# EAGLE design rekick2015-003 (EAGLE 7.5.0)

## Sheet 1 of 7: Spannungsversorgung Primärseite
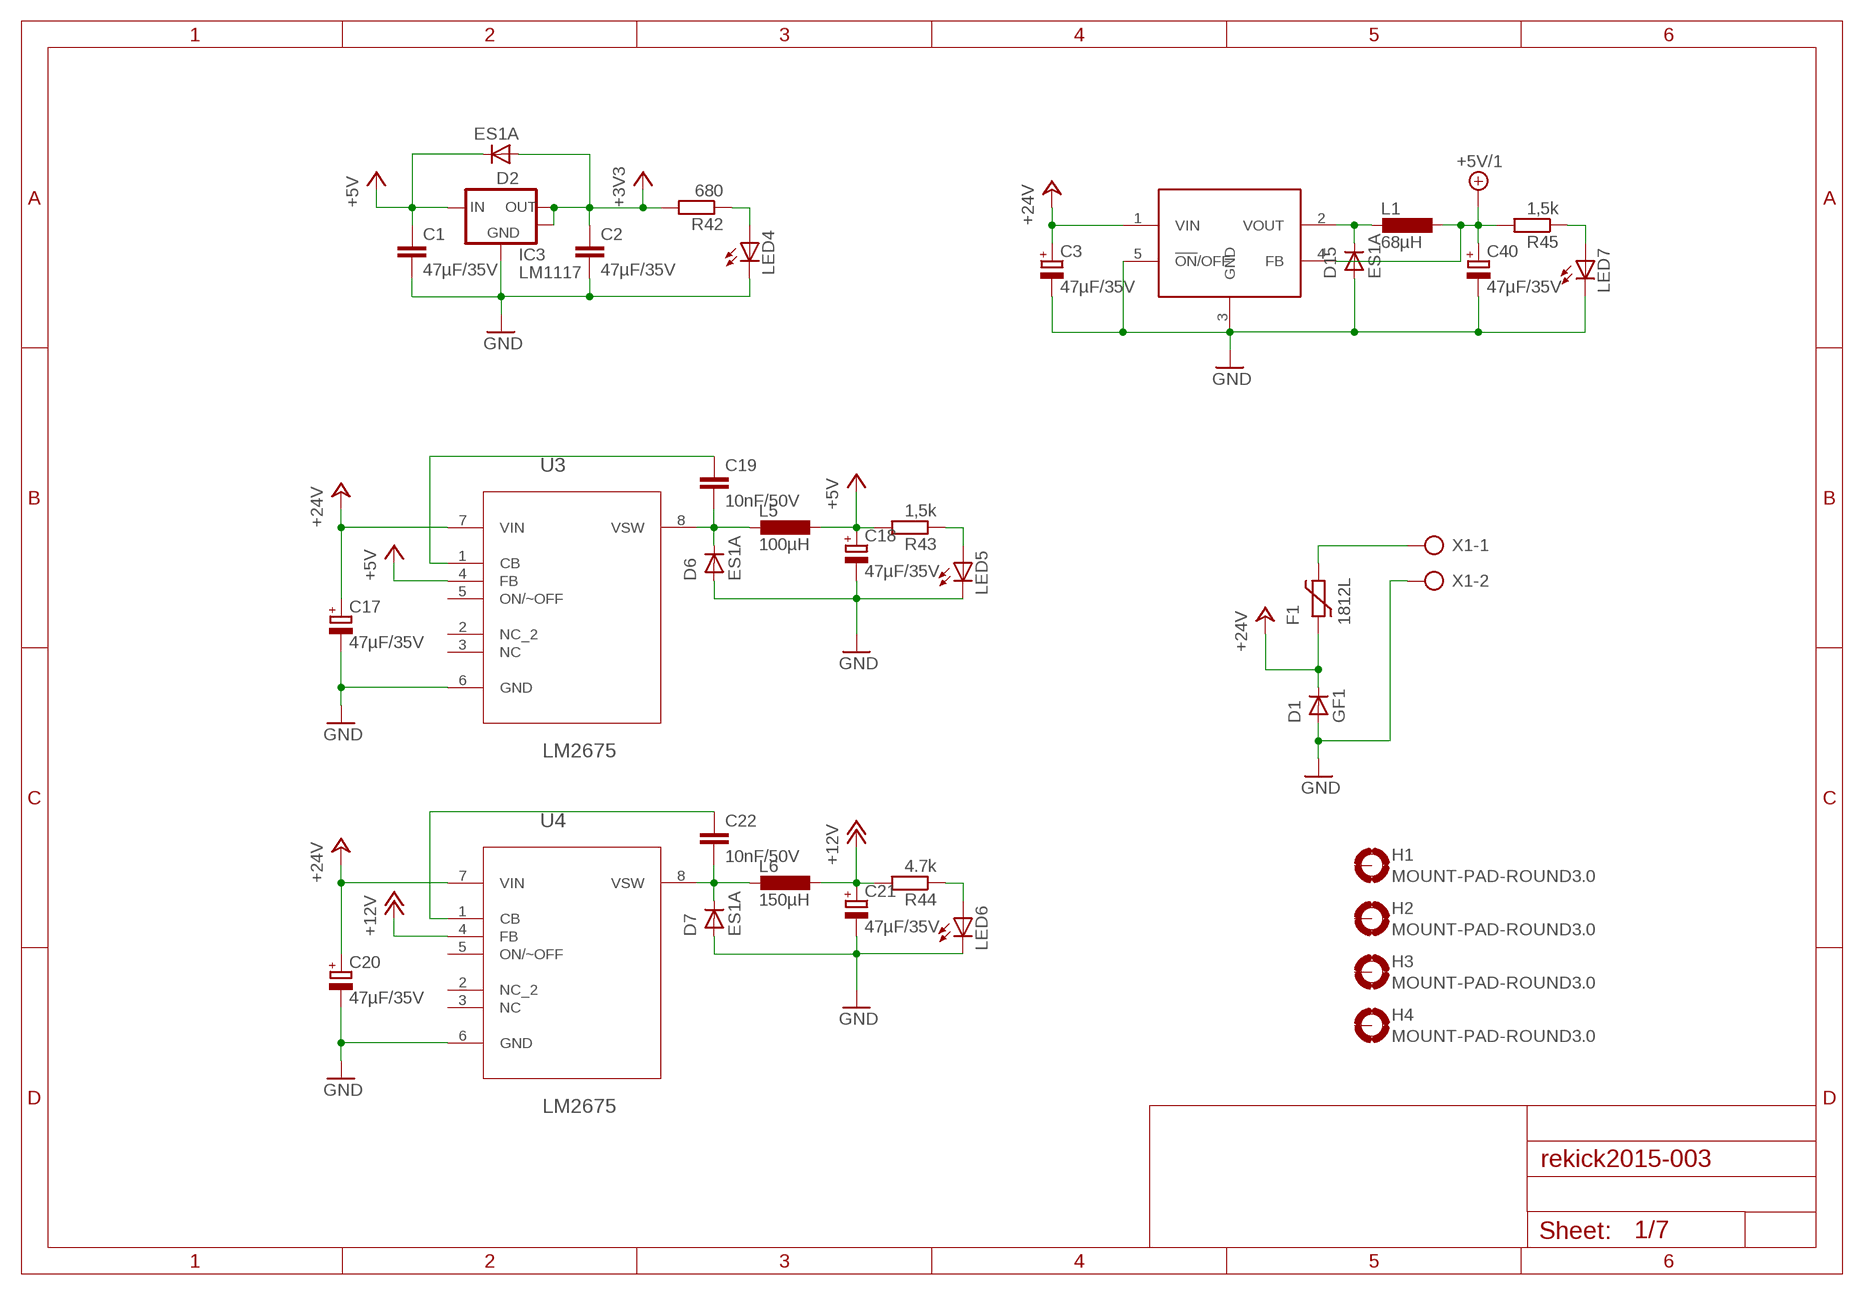
[diagram p0: schematic, sheet 1]

### Parts
C1  47µF/35V  C-EUC0603  [C0603]
C2  47µF/35V  C-EUC0603  [C0603]
C3  47µF/35V  CPOL-EUD  [PANASONIC_D]
C17  47µF/35V  CPOL-EUD  [PANASONIC_D]
C18  47µF/35V  CPOL-EUD  [PANASONIC_D]
C19  10nF/50V  C-EUC0603  [C0603]
C20  47µF/35V  CPOL-EUD  [PANASONIC_D]
C21  47µF/35V  CPOL-EUD  [PANASONIC_D]
C22  10nF/50V  C-EUC0603  [C0603]
C40  47µF/35V  CPOL-EUD  [PANASONIC_D]
D1  GF1  [SMA-DO214AC]
D2  ES1A  GF1  [SMA-DO214AC]
D6  ES1A  GF1  [SMA-DO214AC]
D7  ES1A  GF1  [SMA-DO214AC]
D15  ES1A  GF1  [SMA-DO214AC]
F1  1812L  [1812L]
H1  MOUNT-PAD-ROUND3.0  [3,0-PAD]
H2  MOUNT-PAD-ROUND3.0  [3,0-PAD]
H3  MOUNT-PAD-ROUND3.0  [3,0-PAD]
H4  MOUNT-PAD-ROUND3.0  [3,0-PAD]
IC3  LM1117  [SOT223]
L1  68µH  L-EUPISM  [PISM]
L5  100µH  L-EUPISM  [PISM]
L6  150µH  L-EUPISM  [PISM]
LED4  LEDCHIP-LED0805  [CHIP-LED0805]
LED5  LEDCHIP-LED0805  [CHIP-LED0805]
LED6  LEDCHIP-LED0805  [CHIP-LED0805]
LED7  LEDCHIP-LED0805  [CHIP-LED0805]
R42  680  R-EU_R0805  [R0805]
R43  1,5k  R-EU_R0805  [R0805]
R44  4.7k  R-EU_R0805  [R0805]
R45  1,5k  R-EU_R0805  [R0805]
U3  LM2675  LM2675M-3.3  [SOIC127P620X175-8N]
U4  LM2675  LM2675M-3.3  [SOIC127P620X175-8N]
U$8  LM2576  [TO220511]
X1  AK500/2-H  [AK500/2-H]

### Nets
+3V3: C2.1 D2.A IC3.2(OUT) IC3.4(OUT) R42.2 ; also sheet 3
+5V: C1.1 C18.+ D2.K(C) IC3.3(IN) L5.1 R43.2 U3.4(FB) ; also sheet 2,3,4,5,6,7
+5V/1: C40.+ L1.1 R45.2 U$8.4(FB) ; also sheet 3
+12V: C21.+ L6.1 R44.2 U4.4(FB) ; also sheet 5
+24V: C3.+ C17.+ C20.+ D1.K(C) F1.P$1 U3.7(VIN) U4.7(VIN) U$8.1(VIN) ; also sheet 4,7
GND: C1.2 C2.2 C3.- C17.- C18.- C20.- C21.- C40.- D1.A D6.A D7.A D15.A IC3.1(GND) LED4.C LED5.C LED6.C LED7.C U3.6(GND) U4.6(GND) U$8.3(GND) U$8.5(!ON!/OFF) X1.2 ; also sheet 2,3,4,5,6,7
N$1: C19.2 D6.K(C) L5.2 U3.8(VSW)
N$3: C19.1 U3.1(CB)
N$26: C22.2 D7.K(C) L6.2 U4.8(VSW)
N$30: F1.P$2 X1.1
N$33: C22.1 U4.1(CB)
N$67: LED4.A R42.1
N$69: D15.K(C) L1.2 U$8.2(VOUT)
N$71: LED7.A R45.1
N$72: LED5.A R43.1
N$73: LED6.A R44.1
Unconnected: H1.B3,0(MOUNT) H2.B3,0(MOUNT) H3.B3,0(MOUNT) H4.B3,0(MOUNT) U3.2(NC_2) U3.3(NC) U3.5(ON/~OFF) U4.2(NC_2) U4.3(NC) U4.5(ON/~OFF)

## Sheet 2 of 7: MCU
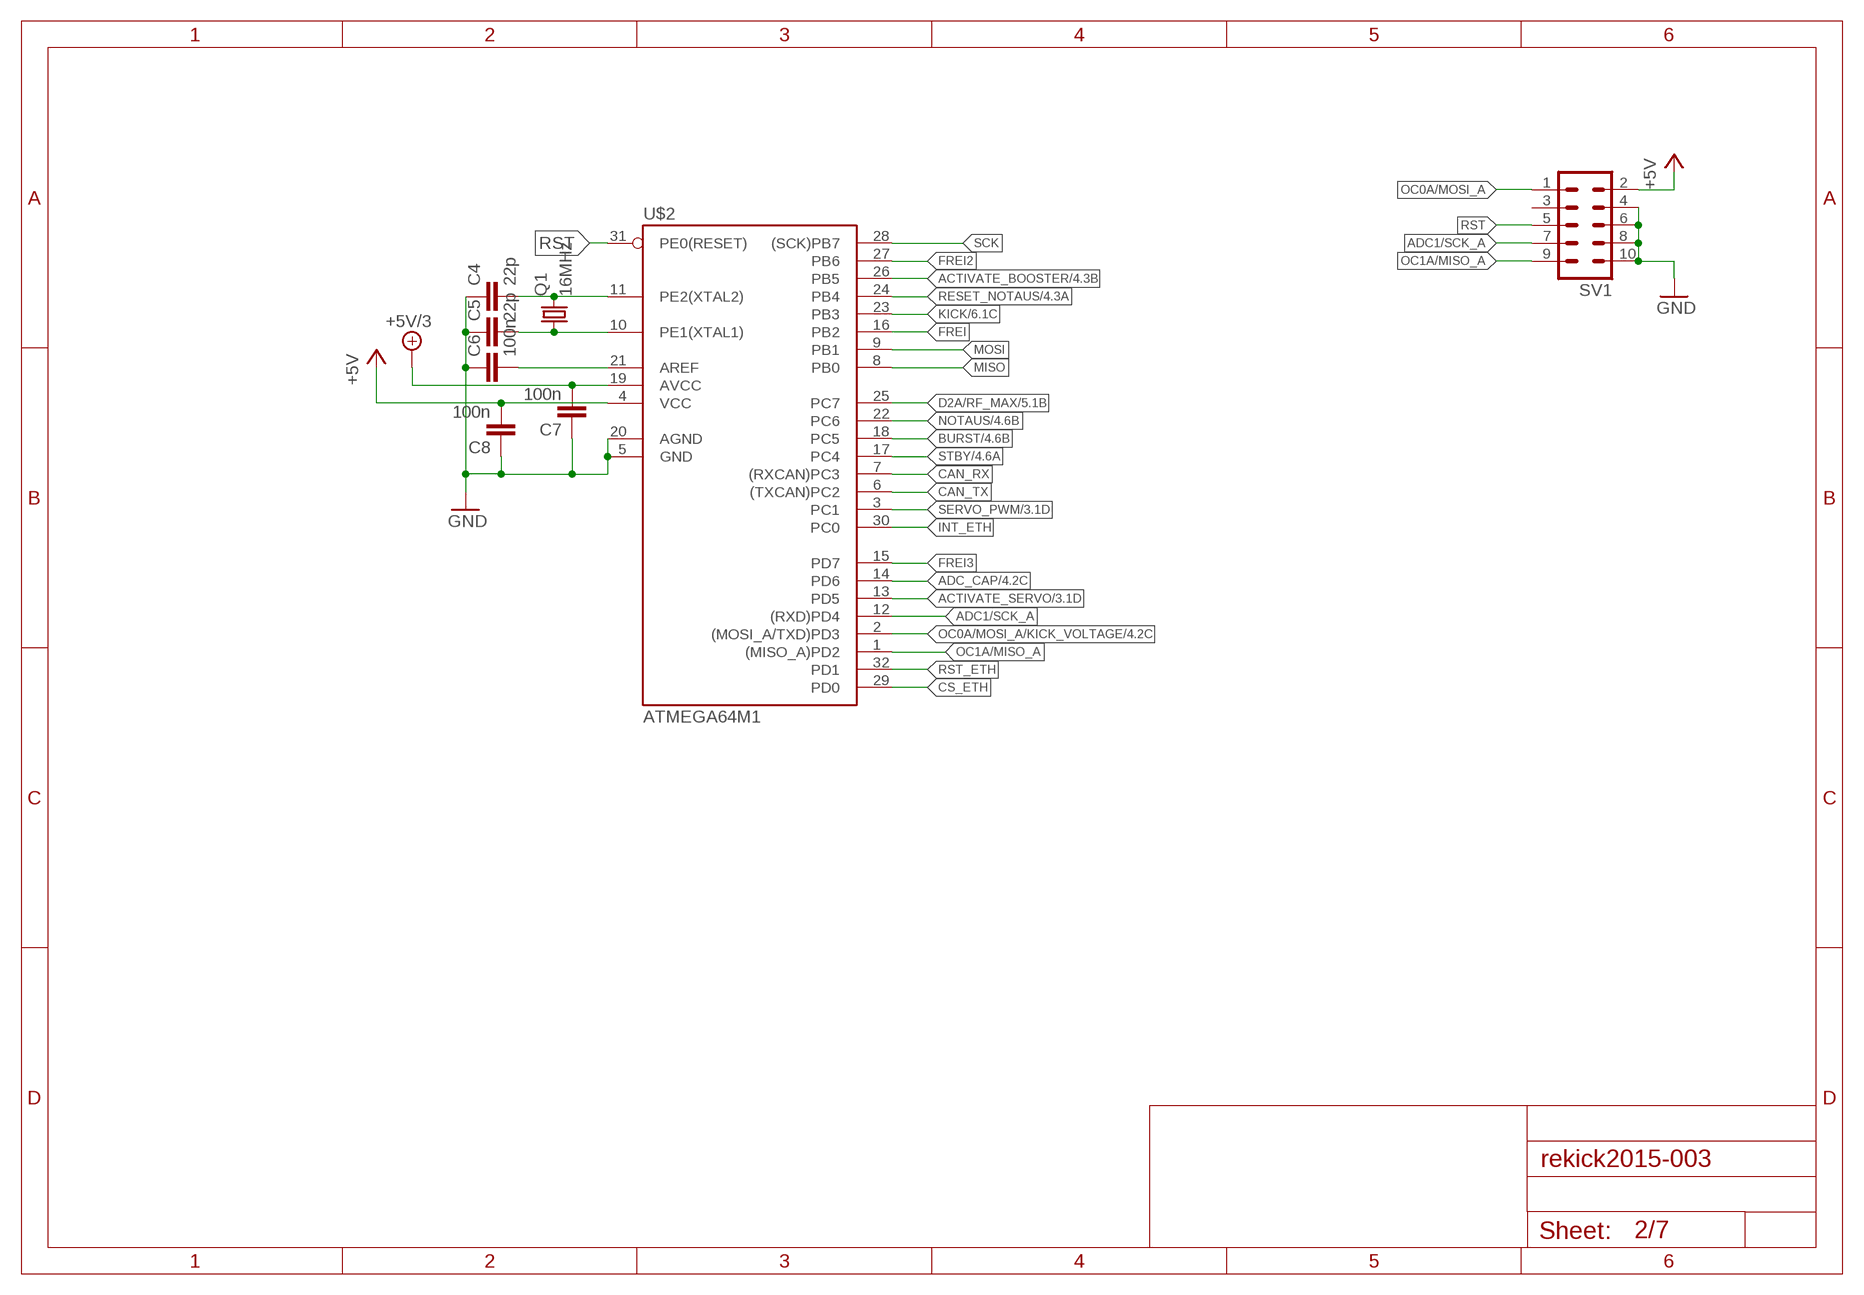
[diagram p1: schematic, sheet 2]

### Parts
C4  22p  C-EUC0603  [C0603]
C5  22p  C-EUC0603  [C0603]
C6  100n  C-EUC0603  [C0603]
C7  100n  C-EUC0603  [C0603]
C8  100n  C-EUC0603  [C0603]
Q1  16MHz  CRYSTALHC49UP  [HC49UP]
SV1  ML10  [ML10]
U$2  ATMEGA64M1  [TQFP32-08]

### Nets
+5V: C8.2 SV1.2 U$2.4(VCC) ; also sheet 1,3,4,5,6,7
+5V/3: C7.2 U$2.19(AVCC) ; also sheet 4,7
ACTIVATE_BOOSTER: U$2.26(PB5) ; also sheet 4,5
ACTIVATE_SERVO: U$2.13(PD5) ; also sheet 3
ADC1/SCK_A: SV1.7 U$2.12((RXD)PD4)
ADC_CAP: U$2.14(PD6) ; also sheet 4,7
BURST: U$2.18(PC5) ; also sheet 4
CAN_RX: U$2.7((RXCAN)PC3) ; also sheet 3
CAN_TX: U$2.6((TXCAN)PC2) ; also sheet 3
CS_ETH: U$2.29(PD0) ; also sheet 3
D2A/RF_MAX: U$2.25(PC7) ; also sheet 5
FREI: U$2.16(PB2)
FREI2: U$2.27(PB6)
FREI3: U$2.15(PD7)
GND: C4.1 C5.1 C6.1 C7.1 C8.1 SV1.4 SV1.6 SV1.8 SV1.10 U$2.5(GND) U$2.20(AGND) ; also sheet 1,3,4,5,6,7
INT_ETH: U$2.30(PC0) ; also sheet 3
KICK: U$2.23(PB3) ; also sheet 6
MISO: U$2.8(PB0) ; also sheet 3
MOSI: U$2.9(PB1) ; also sheet 3
N$5: C4.2 Q1.2 U$2.11(PE2(XTAL2))
N$6: C5.2 Q1.1 U$2.10(PE1(XTAL1))
N$10: C6.2 U$2.21(AREF)
NOTAUS: U$2.22(PC6) ; also sheet 4,6
OC0A/MOSI_A: SV1.1
OC0A/MOSI_A/KICK_VOLTAGE: U$2.2((MOSI_A/TXD)PD3) ; also sheet 4
OC1A/MISO_A: SV1.9 U$2.1((MISO_A)PD2)
RESET_NOTAUS: U$2.24(PB4) ; also sheet 4
RST: SV1.5 U$2.31(PE0(RESET))
RST_ETH: U$2.32(PD1) ; also sheet 3
SCK: U$2.28((SCK)PB7) ; also sheet 3
SERVO_PWM: U$2.3(PC1) ; also sheet 3
STBY: U$2.17(PC4) ; also sheet 4,5
Unconnected: SV1.3

## Sheet 3 of 7: Ethernet & CAN
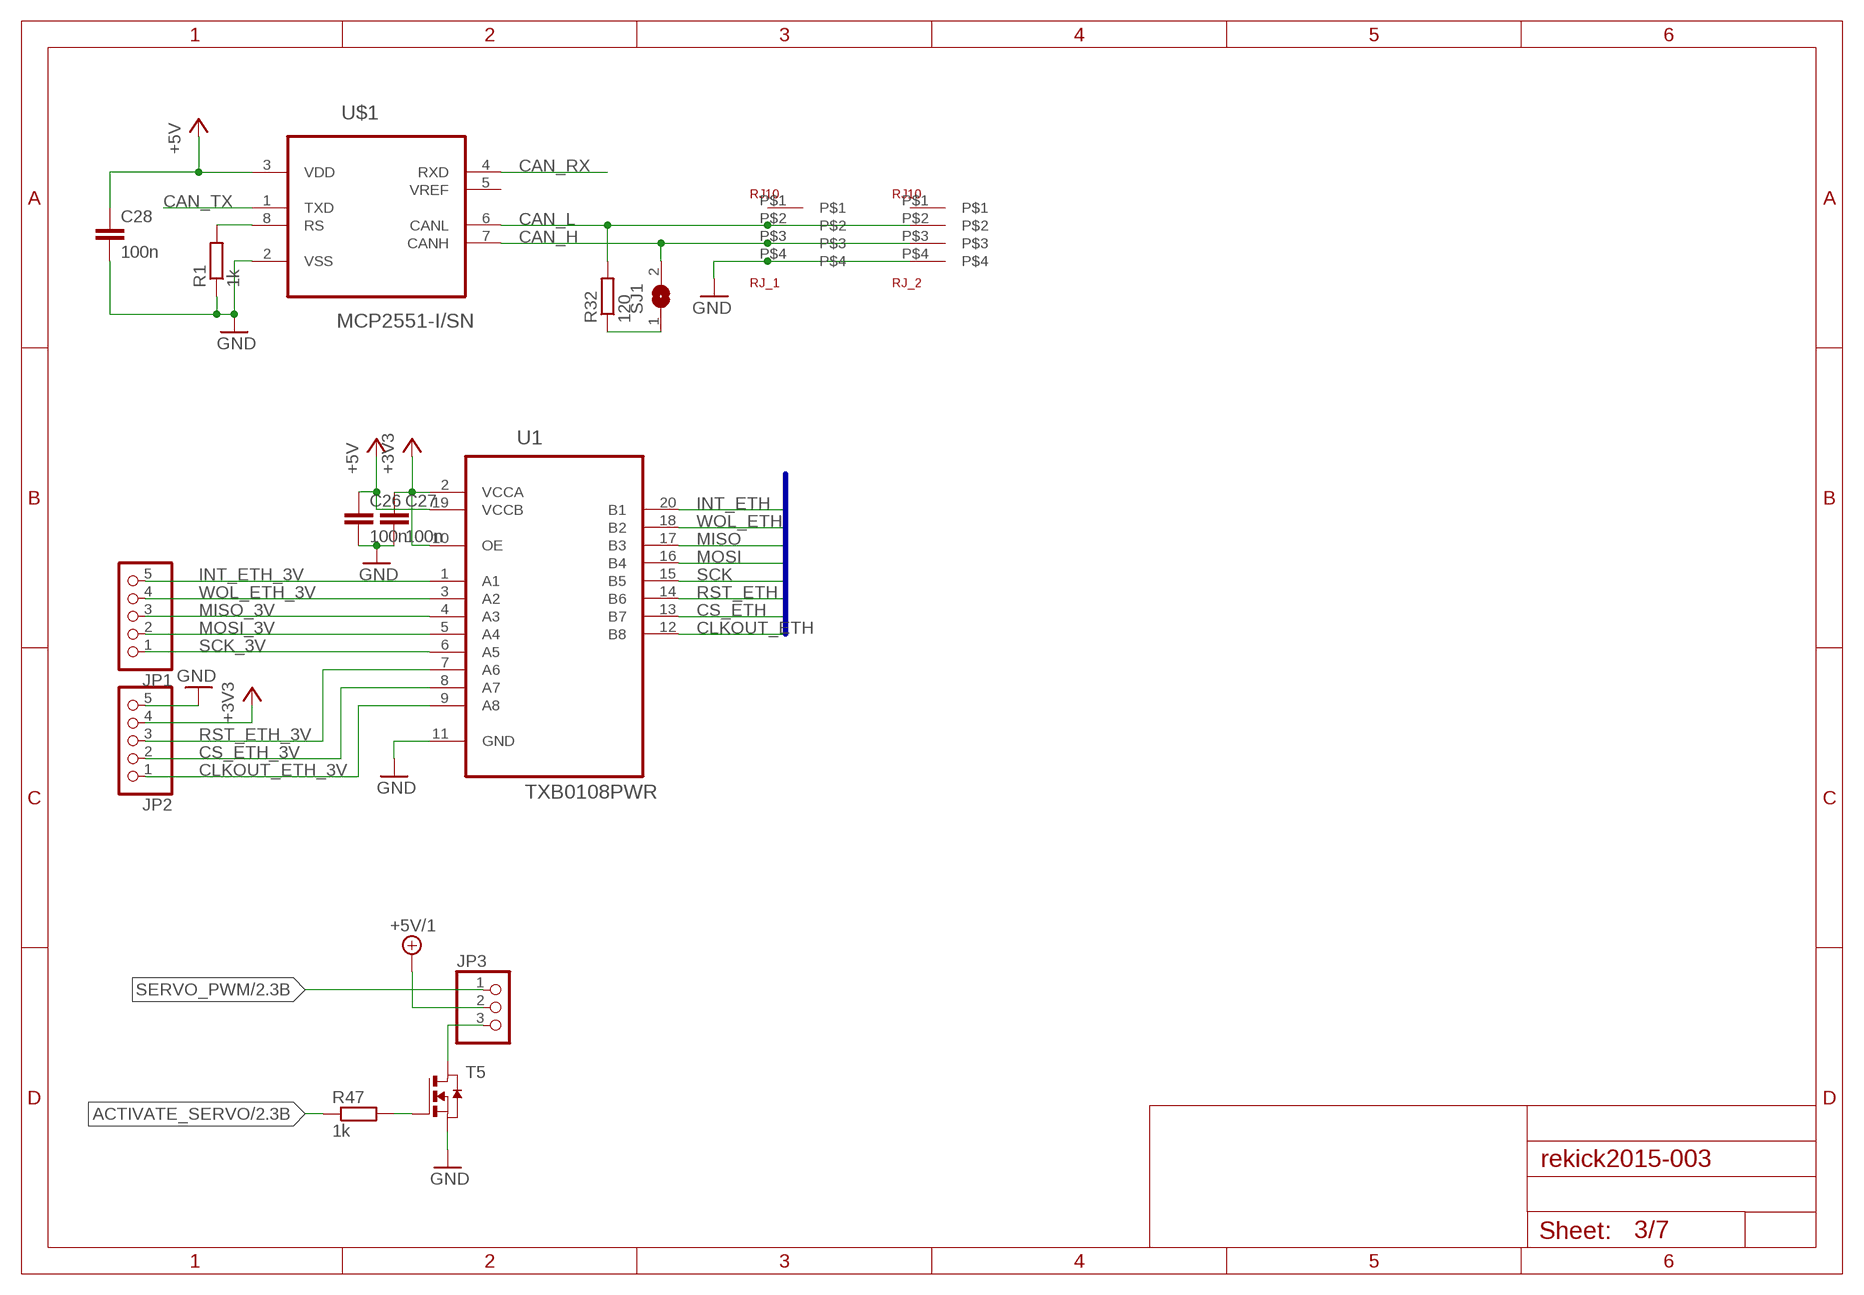
[diagram p2: schematic, sheet 3]

### Parts
C26  100n  C-EUC0603  [C0603]
C27  100n  C-EUC0603  [C0603]
C28  100n  C-EUC0603  [C0603]
JP1  PINHD-1X5  [1X05]
JP2  PINHD-1X5  [1X05]
JP3  PINHD-1X3  [1X03]
R1  1k  R-EU_R0805  [R0805]
R32  120  R-EU_R0805  [R0805]
R47  1k  R-EU_R0805  [R0805]
RJ_1  RJ10  [RJ10]
RJ_2  RJ10  [RJ10]
SJ1  SJ  [SJ]
T5  NMOSSOT23  [SOT-23]
U1  TXB0108PWR  [SOP65P640X120-20N]
U$1  MCP2551-I/SN  [SOIC127P600X175-8N]

### Nets
+3V3: C27.1 JP2.4 U1.2(VCCA) U1.10(OE) ; also sheet 1
+5V: C26.1 C28.1 U1.19(VCCB) U$1.3(VDD) ; also sheet 1,2,4,5,6,7
+5V/1: JP3.2 ; also sheet 1
ACTIVATE_SERVO: R47.1 ; also sheet 2
CAN_H: RJ_1.P$3 RJ_2.P$3 SJ1.2 U$1.7(CANH)
CAN_L: R32.2 RJ_1.P$2 RJ_2.P$2 U$1.6(CANL)
CAN_RX: U$1.4(RXD) ; also sheet 2
CAN_TX: U$1.1(TXD) ; also sheet 2
CLKOUT_ETH: U1.12(B8)
CLKOUT_ETH_3V: JP2.1 U1.9(A8)
CS_ETH: U1.13(B7) ; also sheet 2
CS_ETH_3V: JP2.2 U1.8(A7)
GND: C26.2 C27.2 C28.2 JP2.5 R1.1 RJ_1.P$4 RJ_2.P$4 T5.2(S) U1.11(GND) U$1.2(VSS) ; also sheet 1,2,4,5,6,7
INT_ETH: U1.20(B1) ; also sheet 2
INT_ETH_3V: JP1.5 U1.1(A1)
MISO: U1.17(B3) ; also sheet 2
MISO_3V: JP1.3 U1.4(A3)
MOSI: U1.16(B4) ; also sheet 2
MOSI_3V: JP1.2 U1.5(A4)
N$4: R1.2 U$1.8(RS)
N$9: R32.1 SJ1.1
N$70: JP3.3 T5.1(D)
N$75: R47.2 T5.3(G)
RST_ETH: U1.14(B6) ; also sheet 2
RST_ETH_3V: JP2.3 U1.7(A6)
SCK: U1.15(B5) ; also sheet 2
SCK_3V: JP1.1 U1.6(A5)
SERVO_PWM: JP3.1 ; also sheet 2
WOL_ETH: U1.18(B2)
WOL_ETH_3V: JP1.4 U1.3(A2)
Unconnected: RJ_1.P$1 RJ_2.P$1 U$1.5(VREF)

### Buses
INT_ETH,WOL_ETH,MISO,MOSI,SCK,RST_ETH,CS_ETH,CLKOUT_ETH

## Sheet 4 of 7: Notaus- und Standby-Logik
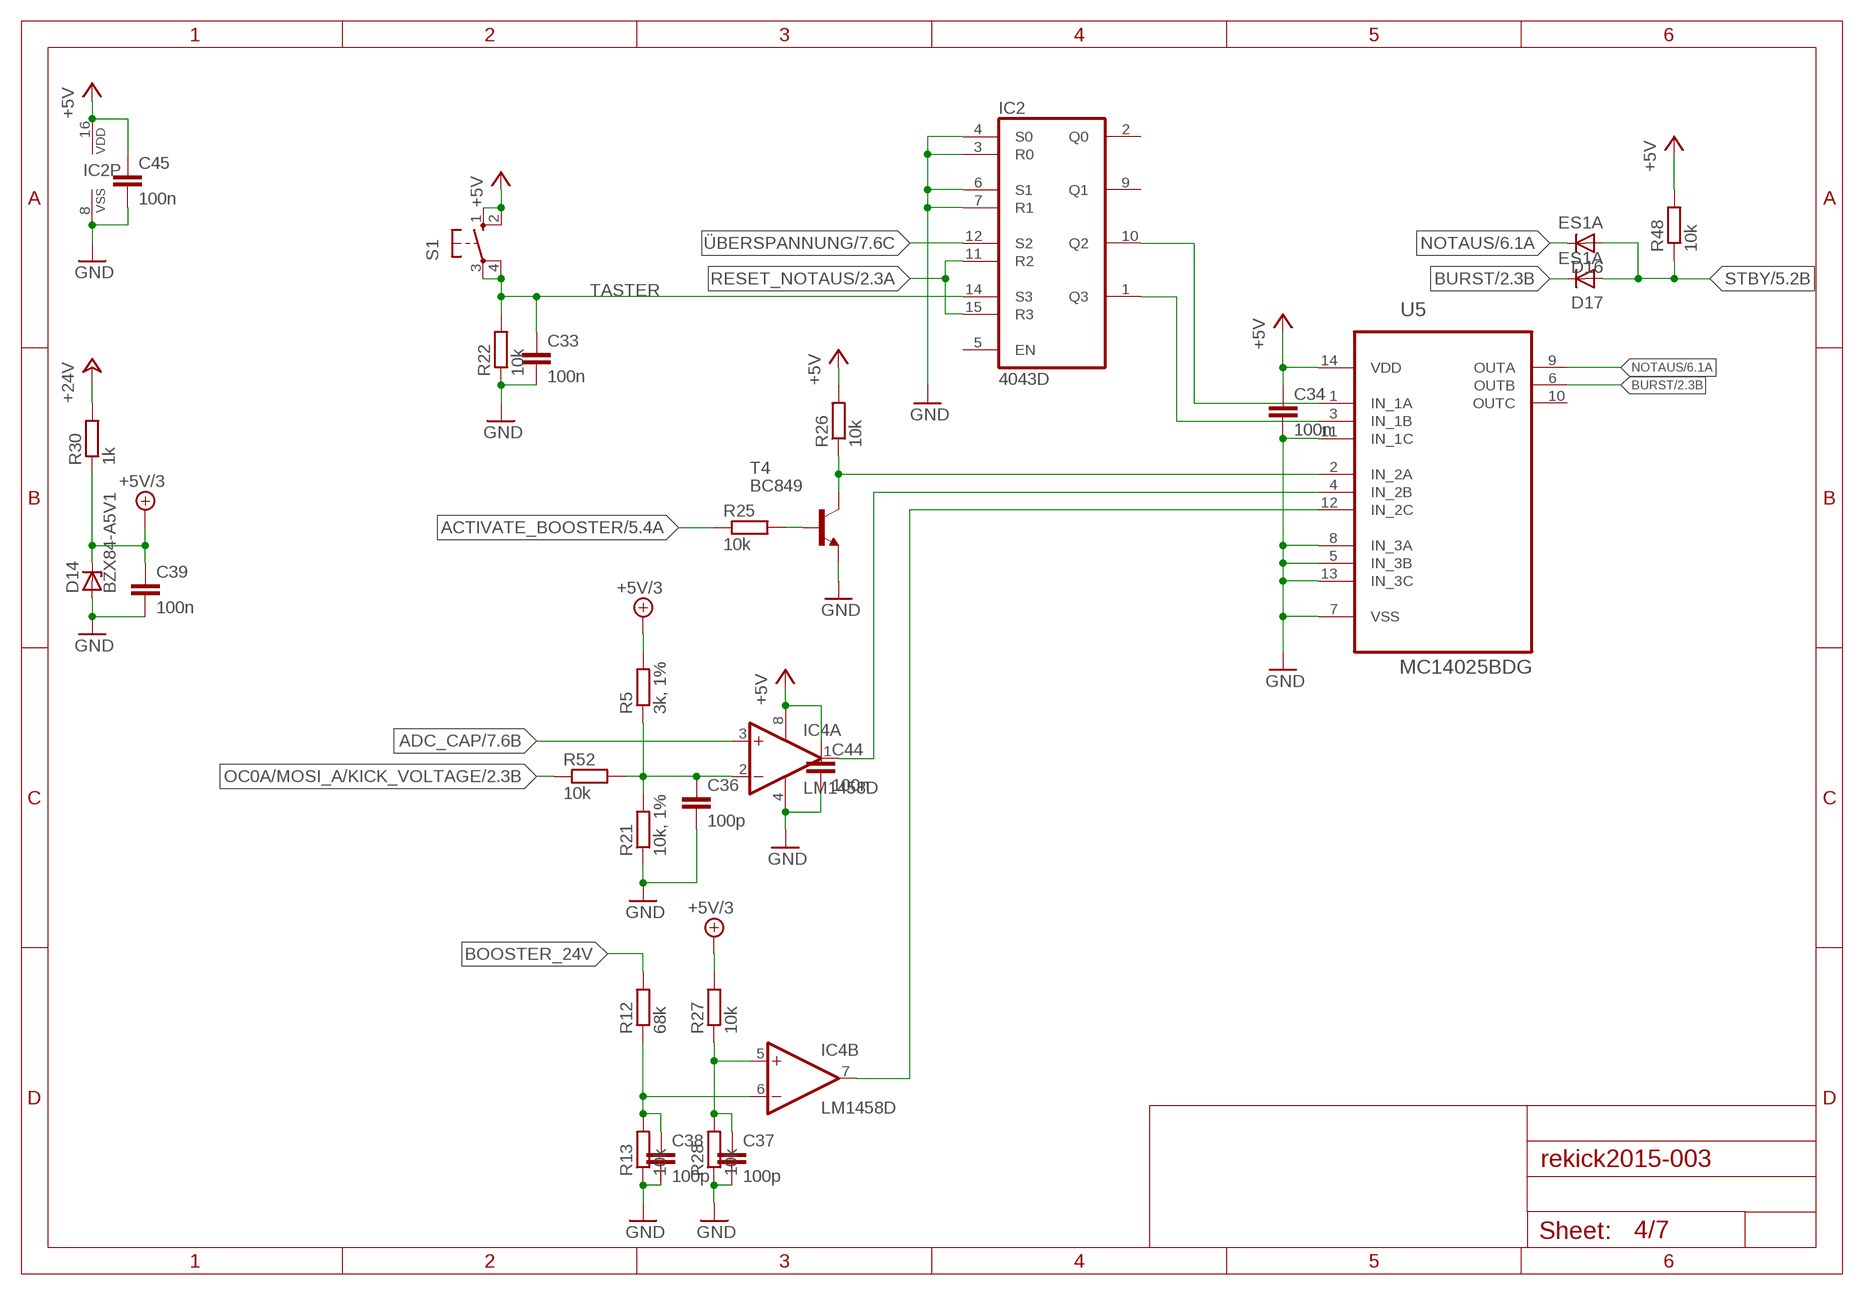
[diagram p3: schematic, sheet 4]

### Parts
C33  100n  C-EUC0603  [C0603]
C34  100n  C-EUC0603  [C0603]
C36  100p  C-EUC0603  [C0603]
C37  100p  C-EUC0603  [C0603]
C38  100p  C-EUC0603  [C0603]
C39  100n  C-EUC0603  [C0603]
C44  100n  C-EUC0603  [C0603]
C45  100n  C-EUC0603  [C0603]
D14  BZX84-A5V1  BZX84CSMD  [TO236]
D16  ES1A  GF1  [SMA-DO214AC]
D17  ES1A  GF1  [SMA-DO214AC]
IC2  4043D  [SO16]
IC4  LM1458D  [SO08]
R5  3k, 1%  R-EU_R0805  [R0805]
R12  68k  R-EU_R0805  [R0805]
R13  10k  R-EU_R0805  [R0805]
R21  10k, 1%  R-EU_R0805  [R0805]
R22  10k  R-EU_R0805  [R0805]
R25  10k  R-EU_R0805  [R0805]
R26  10k  R-EU_R0805  [R0805]
R27  10k  R-EU_R0805  [R0805]
R28  10k  R-EU_R0805  [R0805]
R30  1k  R-EU_R0805  [R0805]
R48  10k  R-EU_R0805  [R0805]
R52  10k  R-EU_R0805  [R0805]
S1  10-XX  [B3F-10XX]
T4  BC849  [SOT23]
U5  MC14025BDG  [SOIC127P600X175-14N]

### Nets
+5V: C34.1 C44.1 C45.1 IC2.16(VDD) IC4.8(P:V+) R26.2 R48.2 S1.1(S) S1.2(S1) U5.14(VDD) ; also sheet 1,2,3,5,6,7
+5V/3: C39.1 D14.C R5.2 R27.2 R30.1 ; also sheet 2,7
+24V: R30.2 ; also sheet 1,7
ACTIVATE_BOOSTER: R25.1 ; also sheet 2,5
ADC_CAP: IC4.3(A:+IN) ; also sheet 2,7
BOOSTER_24V: R12.2 ; also sheet 5
BURST: D17.K(C) U5.6(OUTB) ; also sheet 2
GND: C33.2 C34.2 C36.2 C37.2 C38.2 C39.2 C44.2 C45.2 D14.A IC2.3(R0) IC2.4(S0) IC2.6(S1) IC2.7(R1) IC2.8(VSS) IC4.4(P:V-) R13.1 R21.1 R22.1 R28.1 T4.2(E) U5.5(IN_3B) U5.7(VSS) U5.8(IN_3A) U5.11(IN_1C) U5.13(IN_3C) ; also sheet 1,2,3,5,6,7
KICK_VOLTAGE: C36.1 IC4.2(A:-IN) R5.1 R21.2 R52.2
N$37: IC2.10(Q2) U5.1(IN_1A)
N$38: IC2.1(Q3) U5.3(IN_1B)
N$39: C38.1 IC4.6(B:-IN) R12.1 R13.2
N$50: IC4.1(A:OUT) U5.4(IN_2B)
N$52: R25.2 T4.1(B)
N$53: IC4.7(B:OUT) U5.12(IN_2C)
N$58: R26.1 T4.3(C) U5.2(IN_2A)
N$59: C37.1 IC4.5(B:+IN) R27.1 R28.2
NOTAUS: D16.K(C) U5.9(OUTA) ; also sheet 2,6
OC0A/MOSI_A/KICK_VOLTAGE: R52.1 ; also sheet 2
RESET_NOTAUS: IC2.11(R2) IC2.15(R3) ; also sheet 2
STBY: D16.A D17.A R48.1 ; also sheet 2,5
TASTER: C33.1 IC2.14(S3) R22.2 S1.3(P) S1.4(P1)
ÜBERSPANNUNG: IC2.12(S2) ; also sheet 7
Unconnected: IC2.2(Q0) IC2.5(EN) IC2.9(Q1) U5.10(OUTC)

## Sheet 5 of 7: Resonanz Controller
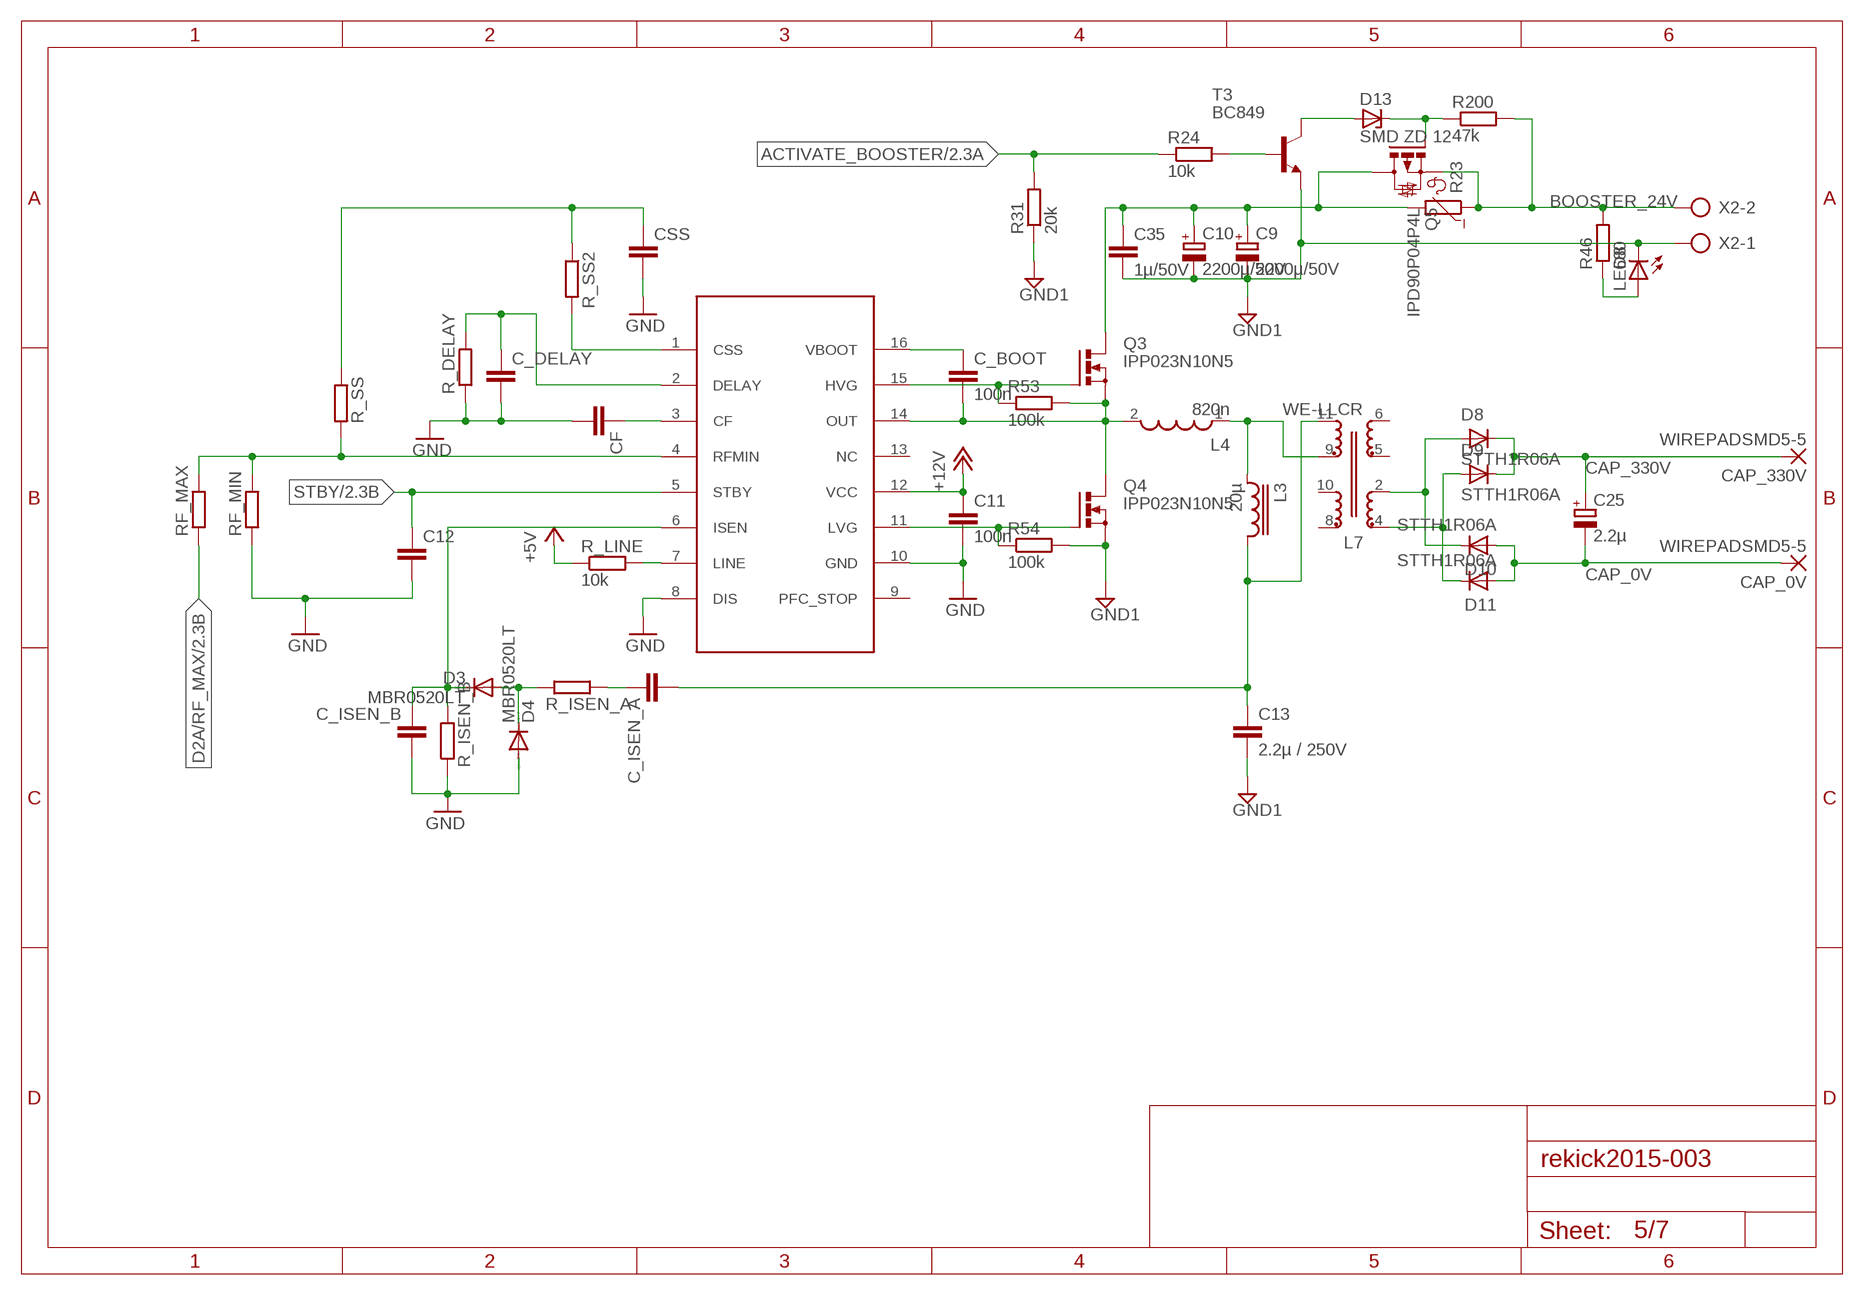
[diagram p4: schematic, sheet 5]

### Parts
C9  2200µ/50V  CPOL-EUE5-13  [E5-13]
C10  2200µ/50V  CPOL-EUE5-13  [E5-13]
C11  100n  C-EUC0603  [C0603]
C12  C-EUC0603  [C0603]
C13  2.2µ / 250V  C-EUC2220K  [C2220K]
C25  2.2µ  CPOL-EUE5-10.5  [E5-10,5]
C35  1µ/50V  C-EUC0603  [C0603]
C_BOOT  100n  C-EUC0603  [C0603]
C_DELAY  C-EUC0603  [C0603]
C_ISEN_A  C-EUC0603  [C0603]
C_ISEN_B  C-EUC0603  [C0603]
CAP_0V  WIREPADSMD5-5  [5-5]
CAP_330V  WIREPADSMD5-5  [5-5]
CF  C-EUC0603  [C0603]
CSS  C-EUC0603  [C0603]
D3  MBR0520LT  [SOD123]
D4  MBR0520LT  [SOD123]
D8  STTH1R06A  GF1  [SMA-DO214AC]
D9  STTH1R06A  GF1  [SMA-DO214AC]
D10  STTH1R06A  GF1  [SMA-DO214AC]
D11  STTH1R06A  GF1  [SMA-DO214AC]
D13  SMD ZD 12  BZX84CSMD  [TO236]
L3  20µ  SRR1210  [SRR1210]
L4  820n  WE-HCI_1890  [WE-HCI_1890]
L7  WE-LLCR  WE-LLCR_ETD34  [WE-LLCR_ETD34]
LED8  LEDCHIP-LED0805  [CHIP-LED0805]
Q3  IPP023N10N5  PMOSFET_NTO220BV  [TO220BV]
Q4  IPP023N10N5  PMOSFET_NTO220BV  [TO220BV]
Q5  IPD90P04P4L  IRFR5305  [D-PAK_TO252AA]
R23  NTC644A  [N644A]
R24  10k  R-EU_R0805  [R0805]
R31  20k  R-EU_R0805  [R0805]
R46  680  R-EU_R0805  [R0805]
R53  100k  R-EU_R0805  [R0805]
R54  100k  R-EU_R0805  [R0805]
R200  47k  R-EU_R0805  [R0805]
R_DELAY  R-EU_R0805  [R0805]
R_ISEN_A  R-EU_R0805  [R0805]
R_ISEN_B  R-EU_R0805  [R0805]
R_LINE  10k  R-EU_R0805  [R0805]
R_SS  R-EU_R0805  [R0805]
R_SS2  R-EU_R0805  [R0805]
RF_MAX  R-EU_R0805  [R0805]
RF_MIN  R-EU_R0805  [R0805]
T3  BC849  [SOT23]
U$3  L6599  [SO16]
X2  AK500/2-H  [AK500/2-H]

### Nets
1.25V-BIS-6V: R_LINE.2 U$3.7(LINE)
+5V: R_LINE.1 ; also sheet 1,2,3,4,6,7
+12V: C11.1 U$3.12(VCC) ; also sheet 1
ACTIVATE_BOOSTER: R24.1 R31.2 ; also sheet 2,4
BOOSTER_24V: Q5.3(S) R23.1 R46.2 R200.2 X2.2 ; also sheet 4
CAP_0V: C25.- CAP_0V.P$1(P) D10.A D11.A ; also sheet 6,7
CAP_330V: C25.+ CAP_330V.P$1(P) D8.K(C) D9.K(C) ; also sheet 6,7
D2A/RF_MAX: RF_MAX.1 ; also sheet 2
GND: C11.2 C12.2 C_DELAY.2 C_ISEN_B.2 CF.2 CSS.2 D4.A R_DELAY.1 R_ISEN_B.1 RF_MIN.1 U$3.8(DIS) U$3.10(GND) ; also sheet 1,2,3,4,6,7
GND1: C9.- C10.- C13.2 C35.2 LED8.C Q4.S R31.1 R54.2 T3.2(E) X2.1
N$7: CSS.1 R_SS2.1 R_SS.1
N$8: R_SS.2 RF_MAX.2 RF_MIN.2 U$3.4(RFMIN)
N$11: CF.1 U$3.3(CF)
N$16: Q3.G R53.1 U$3.15(HVG)
N$17: Q4.G R54.1 U$3.11(LVG)
N$18: R_SS2.2 U$3.1(CSS)
N$19: C_BOOT.1 U$3.16(VBOOT)
N$20: C_DELAY.1 R_DELAY.2 U$3.2(DELAY)
N$28: C_ISEN_B.1 D3.C R_ISEN_B.2 U$3.6(ISEN)
N$29: L3.1 L4.1 L7.9
N$31: D3.A D4.C R_ISEN_A.1
N$32: C_ISEN_A.1 R_ISEN_A.2
N$34: D8.A D10.K(C) L7.2
N$36: D9.A D11.K(C) L7.4
N$54: D13.C Q5.1(G) R200.1
N$55: D13.A T3.3(C)
N$56: R24.2 T3.1(B)
N$57: C9.+ C10.+ C35.1 Q3.D Q5.4(D) R23.2
N$74: LED8.A R46.1
STBY: C12.1 U$3.5(STBY) ; also sheet 2,4
TRAFO1: C_BOOT.2 L4.2 Q3.S Q4.D R53.2 U$3.14(OUT)
TRAFO2: C13.1 C_ISEN_A.2 L3.2 L7.11
Unconnected: L7.5 L7.6 L7.8 L7.10 U$3.9(PFC_STOP) U$3.13(NC)

## Sheet 6 of 7: NOTAUS und KICKER
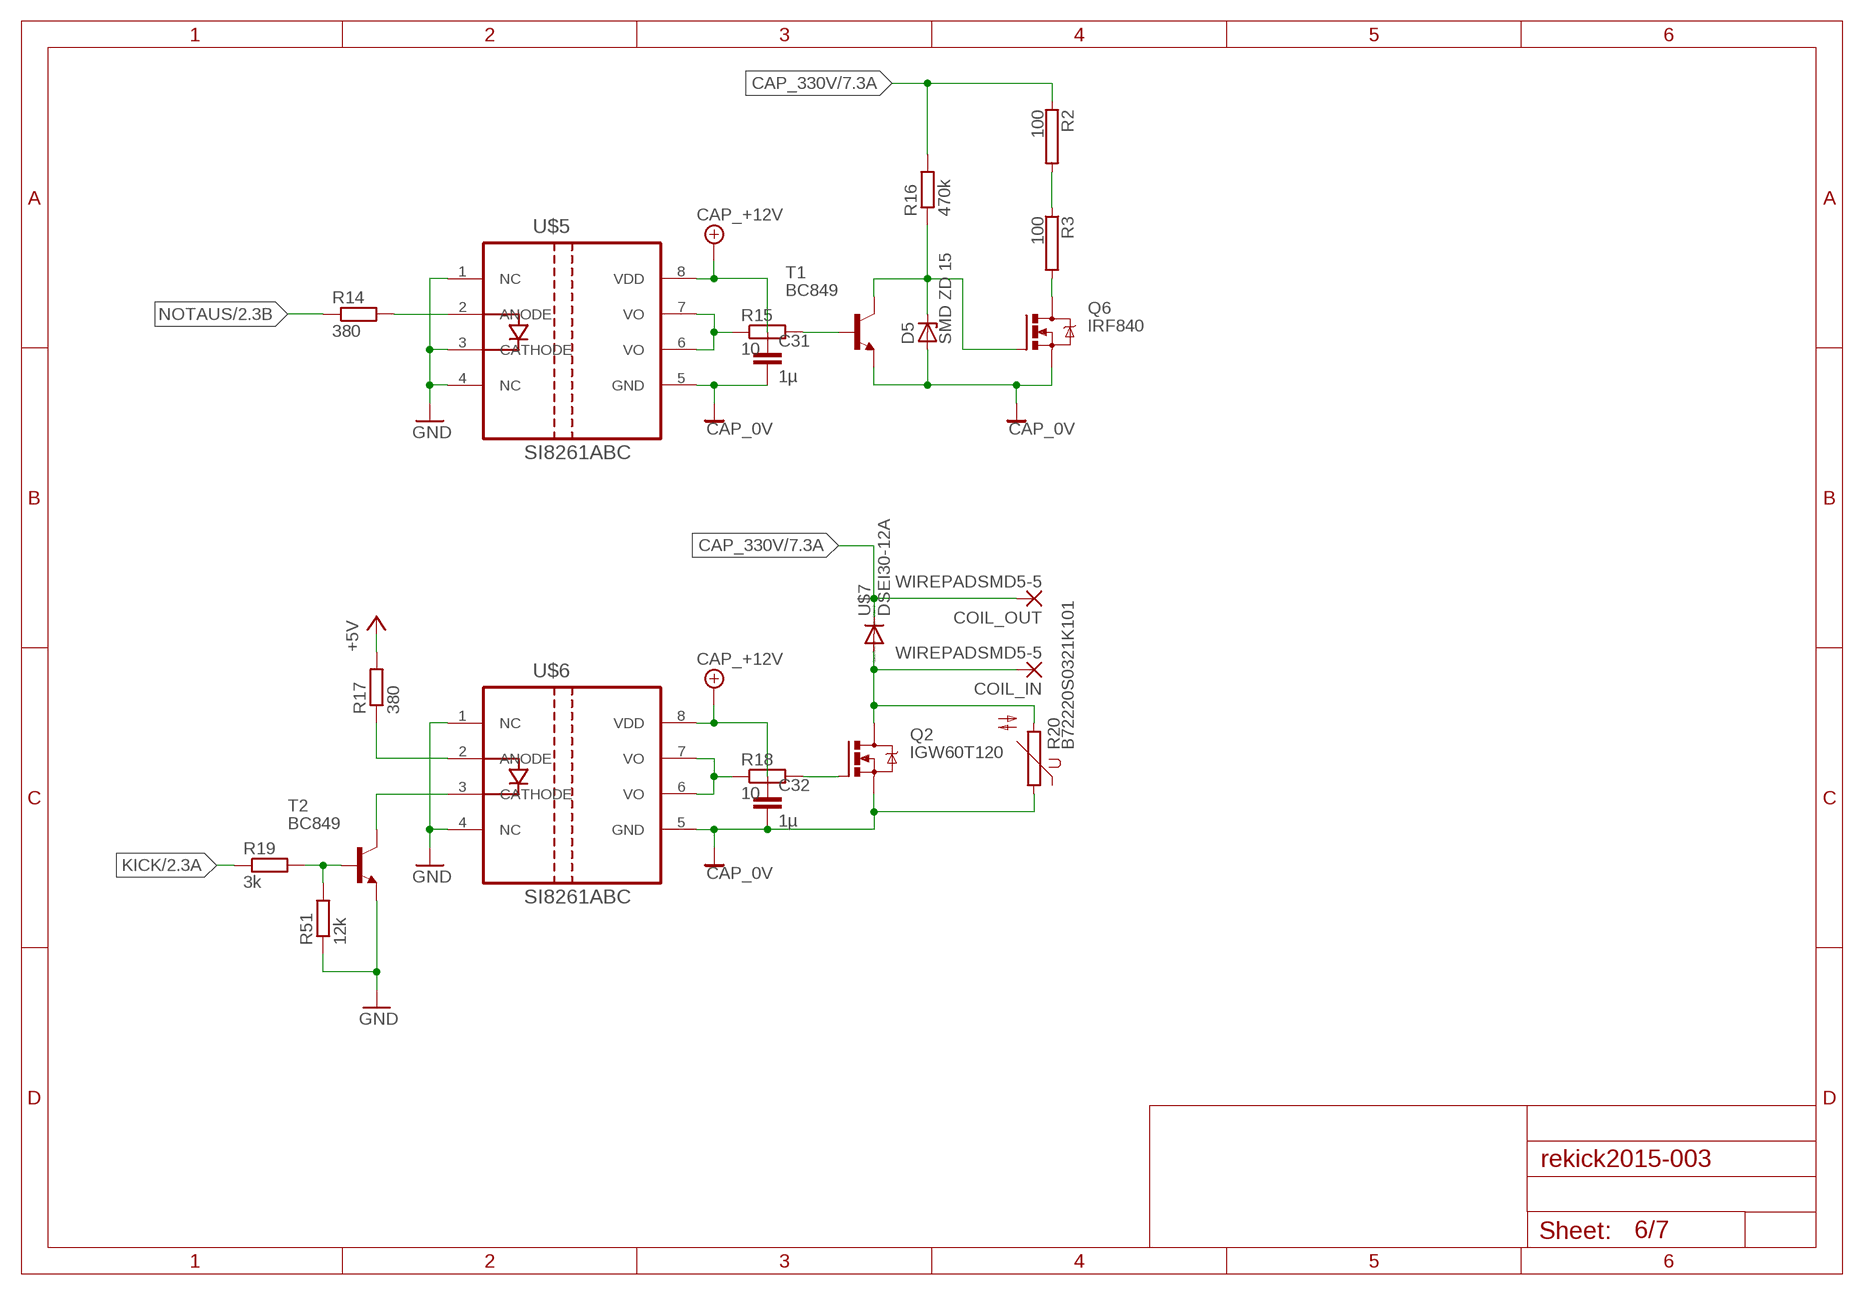
[diagram p5: schematic, sheet 6]

### Parts
C31  1µ  C-EUC0603  [C0603]
C32  1µ  C-EUC0603  [C0603]
COIL_IN  WIREPADSMD5-5  [5-5]
COIL_OUT  WIREPADSMD5-5  [5-5]
D5  SMD ZD 15  BZX84CSMD  [TO236]
Q2  IGW60T120  IRFPC40  [TO247BV]
Q6  IRF840  IRF740  [TO220BV]
R2  100  RHS25  [HS25]
R3  100  RHS25  [HS25]
R14  380  R-EU_R0805  [R0805]
R15  10  R-EU_R0805  [R0805]
R16  470k  R-EU_0207/15  [0207/15]
R17  380  R-EU_R0805  [R0805]
R18  10  R-EU_R0805  [R0805]
R19  3k  R-EU_R0805  [R0805]
R20  B72220S0321K101  S20K320  [S20K320]
R51  12k  R-EU_R0805  [R0805]
T1  BC849  [SOT23]
T2  BC849  [SOT23]
U$5  SI8261ABC  [SOIC-8]
U$6  SI8261ABC  [SOIC-8]
U$7  DSEI30-12A  [TO247AD]

### Nets
+5V: R17.2 ; also sheet 1,2,3,4,5,7
CAP_0V: C31.2 C32.2 D5.A Q2.S Q6.S R20.1 T1.2(E) U$5.5(GND) U$6.5(GND) ; also sheet 5,7
CAP_330V: COIL_OUT.P$1(P) R2.1 R16.2 U$7.C ; also sheet 5,7
CAP_+12V: C31.1 C32.1 U$5.8(VDD) U$6.8(VDD) ; also sheet 7
GND: R51.1 T2.2(E) U$5.1(NC) U$5.3(CATHODE) U$5.4(NC) U$6.1(NC) U$6.4(NC) ; also sheet 1,2,3,4,5,7
KICK: R19.1 ; also sheet 2
N$23: R2.2 R3.1
N$24: Q6.D R3.2
N$40: R14.2 U$5.2(ANODE)
N$41: R15.1 U$5.6(VO) U$5.7(VO)
N$42: T2.3(C) U$6.3(CATHODE)
N$43: R17.1 U$6.2(ANODE)
N$44: R18.1 U$6.6(VO) U$6.7(VO)
N$45: D5.C Q6.G R16.1 T1.3(C)
N$46: R15.2 T1.1(B)
N$47: R19.2 R51.2 T2.1(B)
N$48: Q2.G R18.2
N$49: COIL_IN.P$1(P) Q2.D R20.2 U$7.A
NOTAUS: R14.1 ; also sheet 2,4

## Sheet 7 of 7: Überwachung/Monitoring
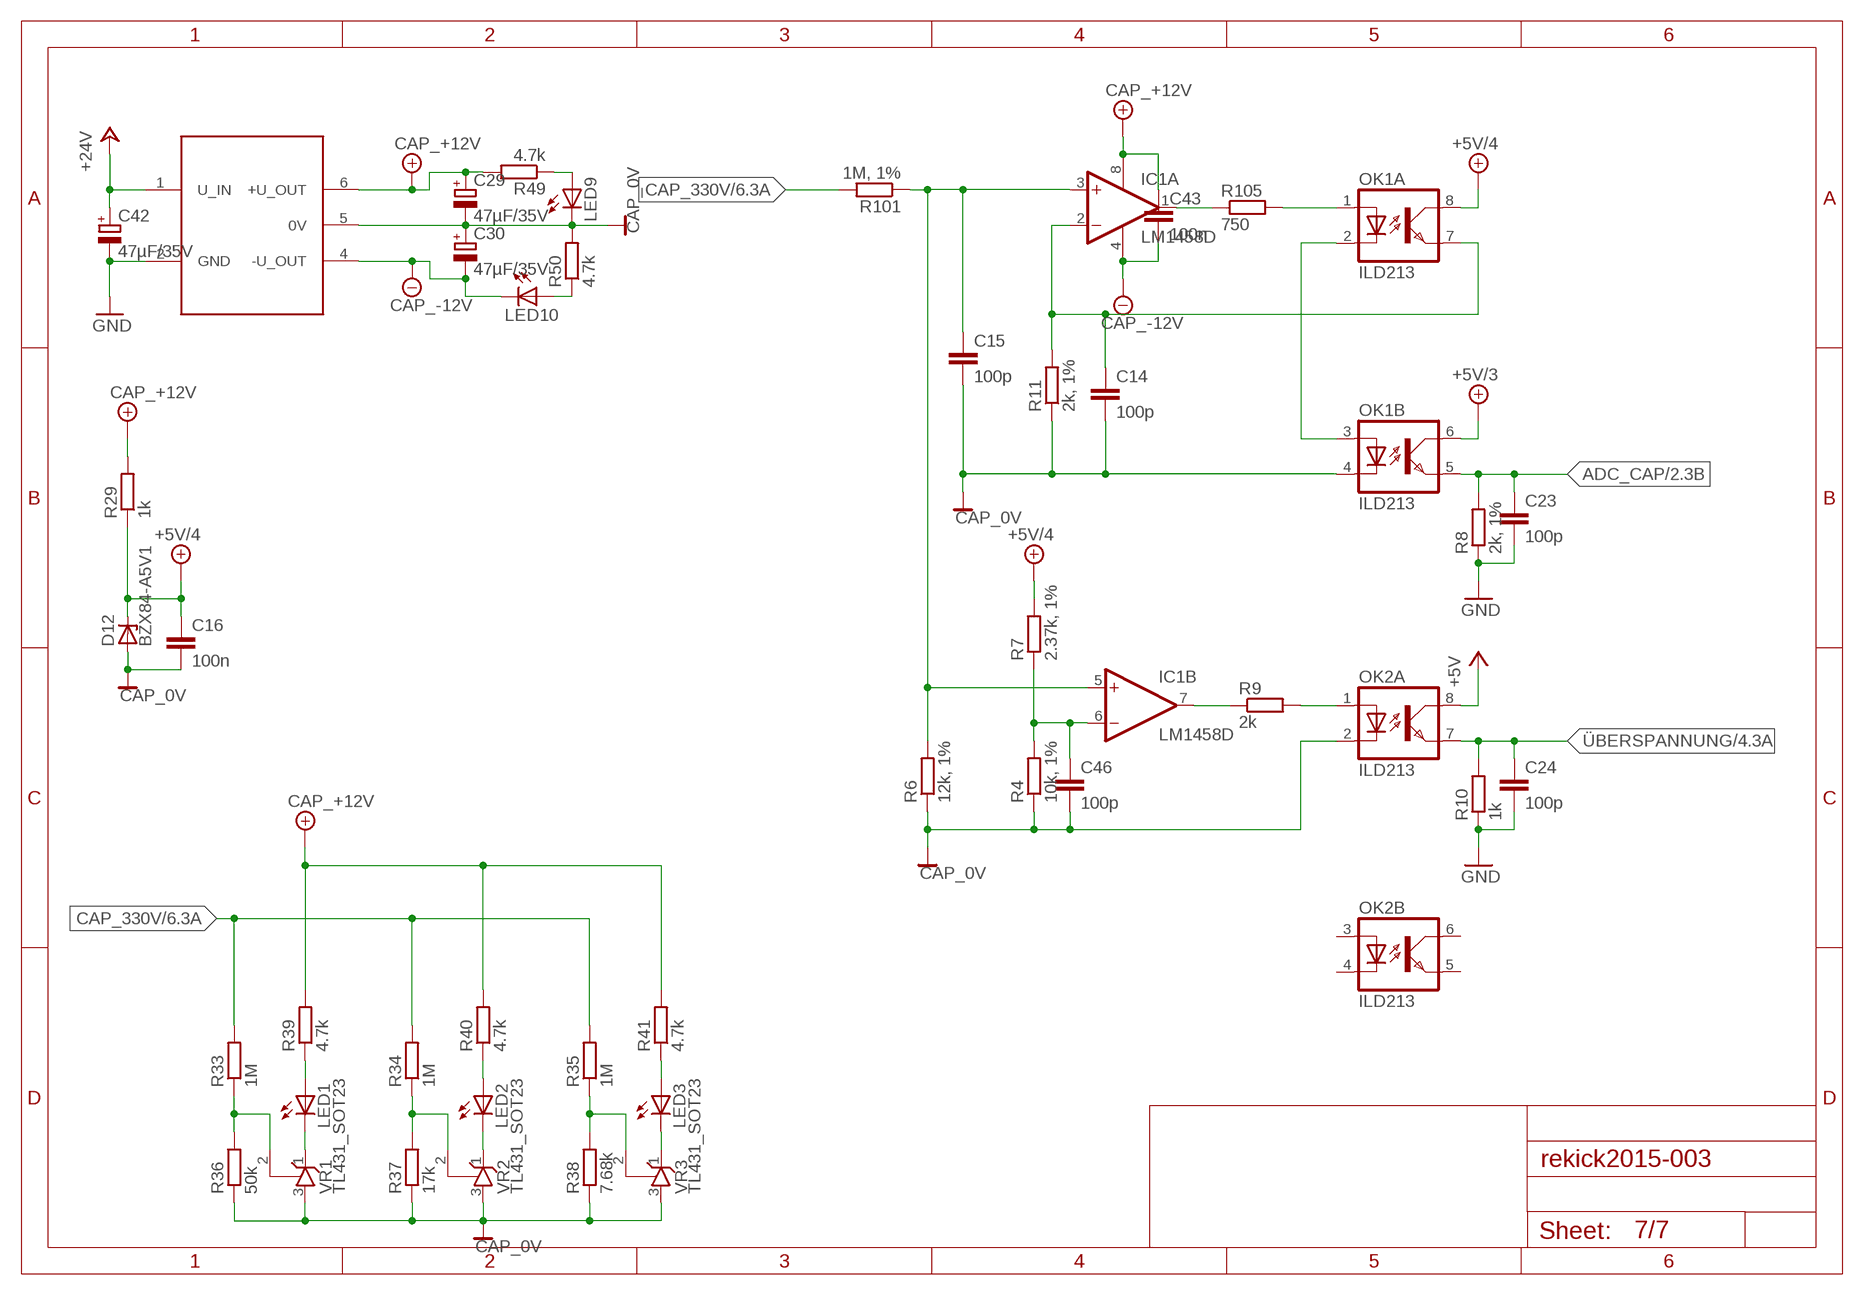
[diagram p6: schematic, sheet 7]

### Parts
C14  100p  C-EUC0603  [C0603]
C15  100p  C-EUC0603  [C0603]
C16  100n  C-EUC0603  [C0603]
C23  100p  C-EUC0603  [C0603]
C24  100p  C-EUC0603  [C0603]
C29  47µF/35V  CPOL-EUD  [PANASONIC_D]
C30  47µF/35V  CPOL-EUD  [PANASONIC_D]
C42  47µF/35V  CPOL-EUD  [PANASONIC_D]
C43  100n  C-EUC0603  [C0603]
C46  100p  C-EUC0603  [C0603]
D12  BZX84-A5V1  BZX84CSMD  [TO236]
IC1  LM1458D  [SO08]
LED1  LEDCHIP-LED0805  [CHIP-LED0805]
LED2  LEDCHIP-LED0805  [CHIP-LED0805]
LED3  LEDCHIP-LED0805  [CHIP-LED0805]
LED9  LEDCHIP-LED0805  [CHIP-LED0805]
LED10  LEDCHIP-LED0805  [CHIP-LED0805]
OK1  ILD213  [SOIC08]
OK2  ILD213  [SOIC08]
R4  10k, 1%  R-EU_R0805  [R0805]
R6  12k, 1%  R-EU_R0805  [R0805]
R7  2.37k, 1%  R-EU_R0805  [R0805]
R8  2k, 1%  R-EU_R0805  [R0805]
R9  2k  R-EU_R0805  [R0805]
R10  1k  R-EU_R0805  [R0805]
R11  2k, 1%  R-EU_R0805  [R0805]
R29  1k  R-EU_R0805  [R0805]
R33  1M  R-EU_R2512  [R2512]
R34  1M  R-EU_R2512  [R2512]
R35  1M  R-EU_R2512  [R2512]
R36  50k  R-EU_R0805  [R0805]
R37  17k  R-EU_R0805  [R0805]
R38  7.68k  R-EU_R0805  [R0805]
R39  4.7k  R-EU_R0805  [R0805]
R40  4.7k  R-EU_R0805  [R0805]
R41  4.7k  R-EU_R0805  [R0805]
R49  4.7k  R-EU_R0805  [R0805]
R50  4.7k  R-EU_R0805  [R0805]
R101  1M, 1%  R-EU_R2512  [R2512]
R105  750  R-EU_R0805  [R0805]
U$4  TMH-D  [TMH-D]
VR1  TL431_SOT23  [SOT23]
VR2  TL431_SOT23  [SOT23]
VR3  TL431_SOT23  [SOT23]

### Nets
+5V: OK2.8(A:COL) ; also sheet 1,2,3,4,5,6
+5V/3: OK1.6(B:COL) ; also sheet 2,4
+5V/4: C16.1 D12.C OK1.8(A:COL) R7.2 R29.1
+24V: C42.+ U$4.1(U_IN) ; also sheet 1,4
ADC_CAP: C23.1 OK1.5(B:EMIT) R8.2 ; also sheet 2,4
CAP_0V: C14.2 C15.2 C16.2 C29.- C30.+ C46.2 D12.A LED9.C OK1.4(B:C) OK2.2(A:C) R4.1 R6.1 R11.1 R36.1 R37.1 R38.1 R50.2 U$4.5(0V) VR1.3(A) VR2.3(A) VR3.3(A) ; also sheet 5,6
CAP_330V: R33.2 R34.2 R35.2 R101.2 ; also sheet 5,6
CAP_+12V: C29.+ C43.1 IC1.8(P:V+) R29.2 R39.2 R40.2 R41.2 R49.2 U$4.6(+U_OUT) ; also sheet 6
CAP_-12V: C30.- C43.2 IC1.4(P:V-) LED10.C U$4.4(-U_OUT)
GND: C23.2 C24.2 C42.- R8.1 R10.1 U$4.2(GND) ; also sheet 1,2,3,4,5,6
N$2: LED1.C VR1.1(C)
N$12: R33.1 R36.2 VR1.2(R)
N$13: IC1.1(A:OUT) R105.1
N$14: C14.1 IC1.2(A:-IN) OK1.7(A:EMIT) R11.2
N$15: C15.1 IC1.3(A:+IN) IC1.5(B:+IN) R6.2 R101.1
N$21: OK1.1(A:A) R105.2
N$22: OK1.2(A:C) OK1.3(B:A)
N$25: IC1.7(B:OUT) R9.1
N$27: C46.1 IC1.6(B:-IN) R4.2 R7.1
N$35: OK2.1(A:A) R9.2
N$60: R34.1 R37.2 VR2.2(R)
N$61: R35.1 R38.2 VR3.2(R)
N$62: LED2.C VR2.1(C)
N$63: LED3.C VR3.1(C)
N$64: LED1.A R39.1
N$65: LED2.A R40.1
N$66: LED3.A R41.1
N$76: LED9.A R49.1
N$77: LED10.A R50.1
ÜBERSPANNUNG: C24.1 OK2.7(A:EMIT) R10.2 ; also sheet 4
Unconnected: OK2.3(B:A) OK2.4(B:C) OK2.5(B:EMIT) OK2.6(B:COL)

## Library data of the parts
C1 C2 C4-C8 C11-C16 C19 C22-C24 C26-C28 C31-C39 C43-C46 C_BOOT C_DELAY C_ISEN_A C_ISEN_B CF CSS = rcl:C-EU: CAPACITOR, European symbol
C3 C9 C10 C17 C18 C20 C21 C25 C29 C30 C40 C42 = rcl:CPOL-EU: POLARIZED CAPACITOR, European symbol
CAP_0V CAP_330V COIL_IN COIL_OUT = mywirepad:WIREPAD: Wire PAD connect wire on PCB
D1 D2 D6-D11 D15-D17 = diode:GF1: DIODE
D3 D4 = diode:MBR0520LT: SCHOTTKY BARRIER RECTIFIER Source: http://onsemi.com .. MBR0520LT1-D.pdf
D5 D12-D14 = diode:BZX84CSMD: Z DIODE
F1 = ptc-littlefuse:1812L
H1-H4 = holes:MOUNT-PAD-ROUND: MOUNTING PAD, round
IC1 IC4 = linear:*1458: OP AMP
IC2 = 40xx:4043: Quad 3-state NOR R/S LATCH
IC3 = LM1117:LM1117
JP1 JP2 = pinhead:PINHD-1X5: PIN HEADER
JP3 = pinhead:PINHD-1X3: PIN HEADER
L1 L5 L6 = Inductor-Fastron:L-EU
L3 = inductor-bourns:SRR1210: POWER INDUCTOR
L4 = EagleLibrary_Wuerth_Elektronik_eiSos_rev16a:WE-HCI: SMD Flat Wire High Current Inductor Characteristics Magnetically shielded Flat wire coil for low losses at high frequency Low stray field Operating temperature: –40 °C to +150/155 °C Applications Graphic cards Laptops Industrial computers Motherboards High current switching regulators DC/DC converter Polyphase-switching regulators Filter <http://katalog.we-online.de/media/images/eisos/IndHCI_pf2.jpg> Details see: http://katalog.we-online.de/en/pbs/WE-HCI? Updated by Dan Xu 2014-07-07 2014 (C) Wurth Elektronik
L7 = EagleLibrary_Wuerth_Elektronik_eiSos_rev15h:WE-LLCR: Characteristics Characteristics Transformer for high efficiency power supply Input voltage 360–400 VDC Switching frequency 70–120 kHz Output power 150 W–250 W Testing voltage 4 kVAC Litz wire for low eddy current losses Defined leakage inductance for use without additional resonant inductor Applications Power supplies for PC, netbook, LED lighting and other power supplies High efficient resonant converters <http://katalog.we-online.de/media/images/eisos/UtLLCR_pf2.jpg> Details see: http://katalog.we-online.de/en/pbs/WE-LLCR? Updated by Dan Xu 2014-07-07 2014 (C) Wurth Elektronik
LED1-LED10 = led:LED: LED OSRAM: - CHIPLED LG R971, LG N971, LY N971, LG Q971, LY Q971, LO R971, LY R971 LH N974, LH R974 LS Q976, LO Q976, LY Q976 LO Q996 - Hyper CHIPLED LW Q18S LB Q993, LB Q99A, LB R99A - SideLED LS A670, LO A670, LY A670, LG A670, LP A670 LB A673, LV A673, LT A673, LW A673 LH A674 LY A675 LS A676, LA A676, LO A676, LY A676, LW A676 LS A679, LY A679, LG A679 - Hyper Micro SIDELED® LS Y876, LA Y876, LO Y876, LY Y876 LT Y87S - SmartLED LW L88C, LW L88S LB L89C, LB L89S, LG L890 LS L89K, LO L89K, LY L89K LS L896, LA L896, LO L896, LY L896 - TOPLED LS T670, LO T670, LY T670, LG T670, LP T670 LSG T670, LSP T670, LSY T670, LOP T670, LYG T670 LG T671, LOG T671, LSG T671 LB T673, LV T673, LT T673, LW T673 LH T674 LS T676, LA T676, LO T676, LY T676, LB T676, LH T676, LSB T676, LW T676 LB T67C, LV T67C, LT T67C, LS T67K, LO T67K, LY T67K, LW E67C LS E67B, LA E67B, LO E67B, LY E67B, LB E67C, LV E67C, LT E67C LW T67C LS T679, LY T679, LG T679 LS T770, LO T770, LY T770, LG T770, LP T770 LB T773, LV T773, LT T773, LW T773 LH T774 LS E675, LA E675, LY E675, LS T675 LS T776, LA T776, LO T776, LY T776, LB T776 LHGB T686 LT T68C, LB T68C - Hyper Mini TOPLED® LB M676 - Mini TOPLED Santana® LG M470 LS M47K, LO M47K, LY M47K Source: http://www.osram.convergy.de LUXEON: - LUMILED® LXK2-PW12-R00, LXK2-PW12-S00, LXK2-PW14-U00, LXK2-PW14-V00 LXK2-PM12-R00, LXK2-PM12-S00, LXK2-PM14-U00 LXK2-PE12-Q00, LXK2-PE12-R00, LXK2-PE12-S00, LXK2-PE14-T00, LXK2-PE14-U00 LXK2-PB12-K00, LXK2-PB12-L00, LXK2-PB12-M00, LXK2-PB14-N00, LXK2-PB14-P00, LXK2-PB14-Q00 LXK2-PR12-L00, LXK2-PR12-M00, LXK2-PR14-Q00, LXK2-PR14-R00 LXK2-PD12-Q00, LXK2-PD12-R00, LXK2-PD12-S00 LXK2-PH12-R00, LXK2-PH12-S00 LXK2-PL12-P00, LXK2-PL12-Q00, LXK2-PL12-R00 Source: www.luxeon.com KINGBRIGHT: KA-3528ASYC Source: www.kingbright.com
OK1 OK2 = optocoupler:ILD2*: Siemens ILD205/206/207/211/213/217 DUAL PHOTOTRANSISTOR SMALL OUTLINE SURFACE MOUNT OPTOCOUPLER Source: 153385-da-01-en-Optocoupler_ILD205-T.pdf
Q1 = crystal:CRYSTAL: CRYSTAL
Q2 = transistor-power:IRFPC40: N-CHANNEL MOS FET
Q3 Q4 = transistor-power:PMOSFET_N: Power MOSFET N-Channel
Q5 = transistor-power:IRF?5305: HEXFET Power MOSFET Source: http://www.irf.com/product-info/datasheets/data/irfr5305pbf.pdf
Q6 = transistor-power:IRF740: N-CHANNEL MOS FET
R1 R4-R19 R21 R22 R24-R54 R101 R105 R200 R_DELAY R_ISEN_A R_ISEN_B R_LINE R_SS R_SS2 RF_MAX RF_MIN = rcl:R-EU_: RESISTOR, European symbol
R2 R3 = resistor-power:R: Power Resitor
R20 = varistor:S20K320: VARISTOR
R23 = ptc-ntc:NTC644A: PHILIPS NTC
RJ_1 RJ_2 = ownParts:RJ10
S1 = switch-omron:10-XX: OMRON SWITCH
SJ1 = jumper:SJ: SMD solder JUMPER
SV1 = con-ml:ML10: HARTING
T1-T4 = transistor:BC849: NPN TRANSISTOR
T5 = zetex:NMOSSOT23: MOS FET; OC_FARNELL: unknown; OC_NEWARK: unknown
U1 = TI-TXB0108PWR:TXB0108PWR: 8-BIT BIDIRECTIONAL VOLTAGE-LEVEL TRANSLATOR; MPN: TXB0108PWR; OC_FARNELL: 1494945; OC_NEWARK: 27M1151; PACKAGE: TSSOP-20; SUPPLIER: Texas Instruments
U3 U4 = LM2675M-3.3:LM2675M-3.3: Step-Down Voltage Regulator; MPN: LM2675M-3.3; OC_FARNELL: 9489800; OC_NEWARK: 41K4140; PACKAGE: 8-SOIC; SUPPLIER: National Semiconductors
U5 = MC14025BDG:MC14025BDG: B-Suffix Series CMOS Gates; MPN: MC14025BDG; OC_FARNELL: 1191824; OC_NEWARK: 26K3933; PACKAGE: SOIC-14; SUPPLIER: ON SEMICONDUCTOR
U$1 = Microchip-MCP2551-I_SN:MCP2551-I/SN: High-Speed CAN Transceiver; MPN: MCP2551-I/SN; OC_FARNELL: 9758569; OC_NEWARK: 69K7604; PACKAGE: SOIC-8; SUPPLIER: Microchip
U$2 = atmega16m1-32m1-64m1:ATMEGA64M1
U$3 = l6599:L6599
U$4 = traco-tm:TMH-D
U$5 U$6 = Si8261:SI8261ABC
U$7 = dsei30-12a:DSEI30-12A
U$8 = LM2576:LM2576
VR1-VR3 = 1_USER:TL431
X1 X2 = con-ptr500:AK500/2-H: CONNECTOR Aug. 2004 / PTR Meßtechnik: Die Bezeichnung der Serie AK505 wurde geändert. Es handelt sich hierbei um AK500 in horizontaler Ausführung.; OC_FARNELL: unknown; OC_NEWARK: unknown

## Board
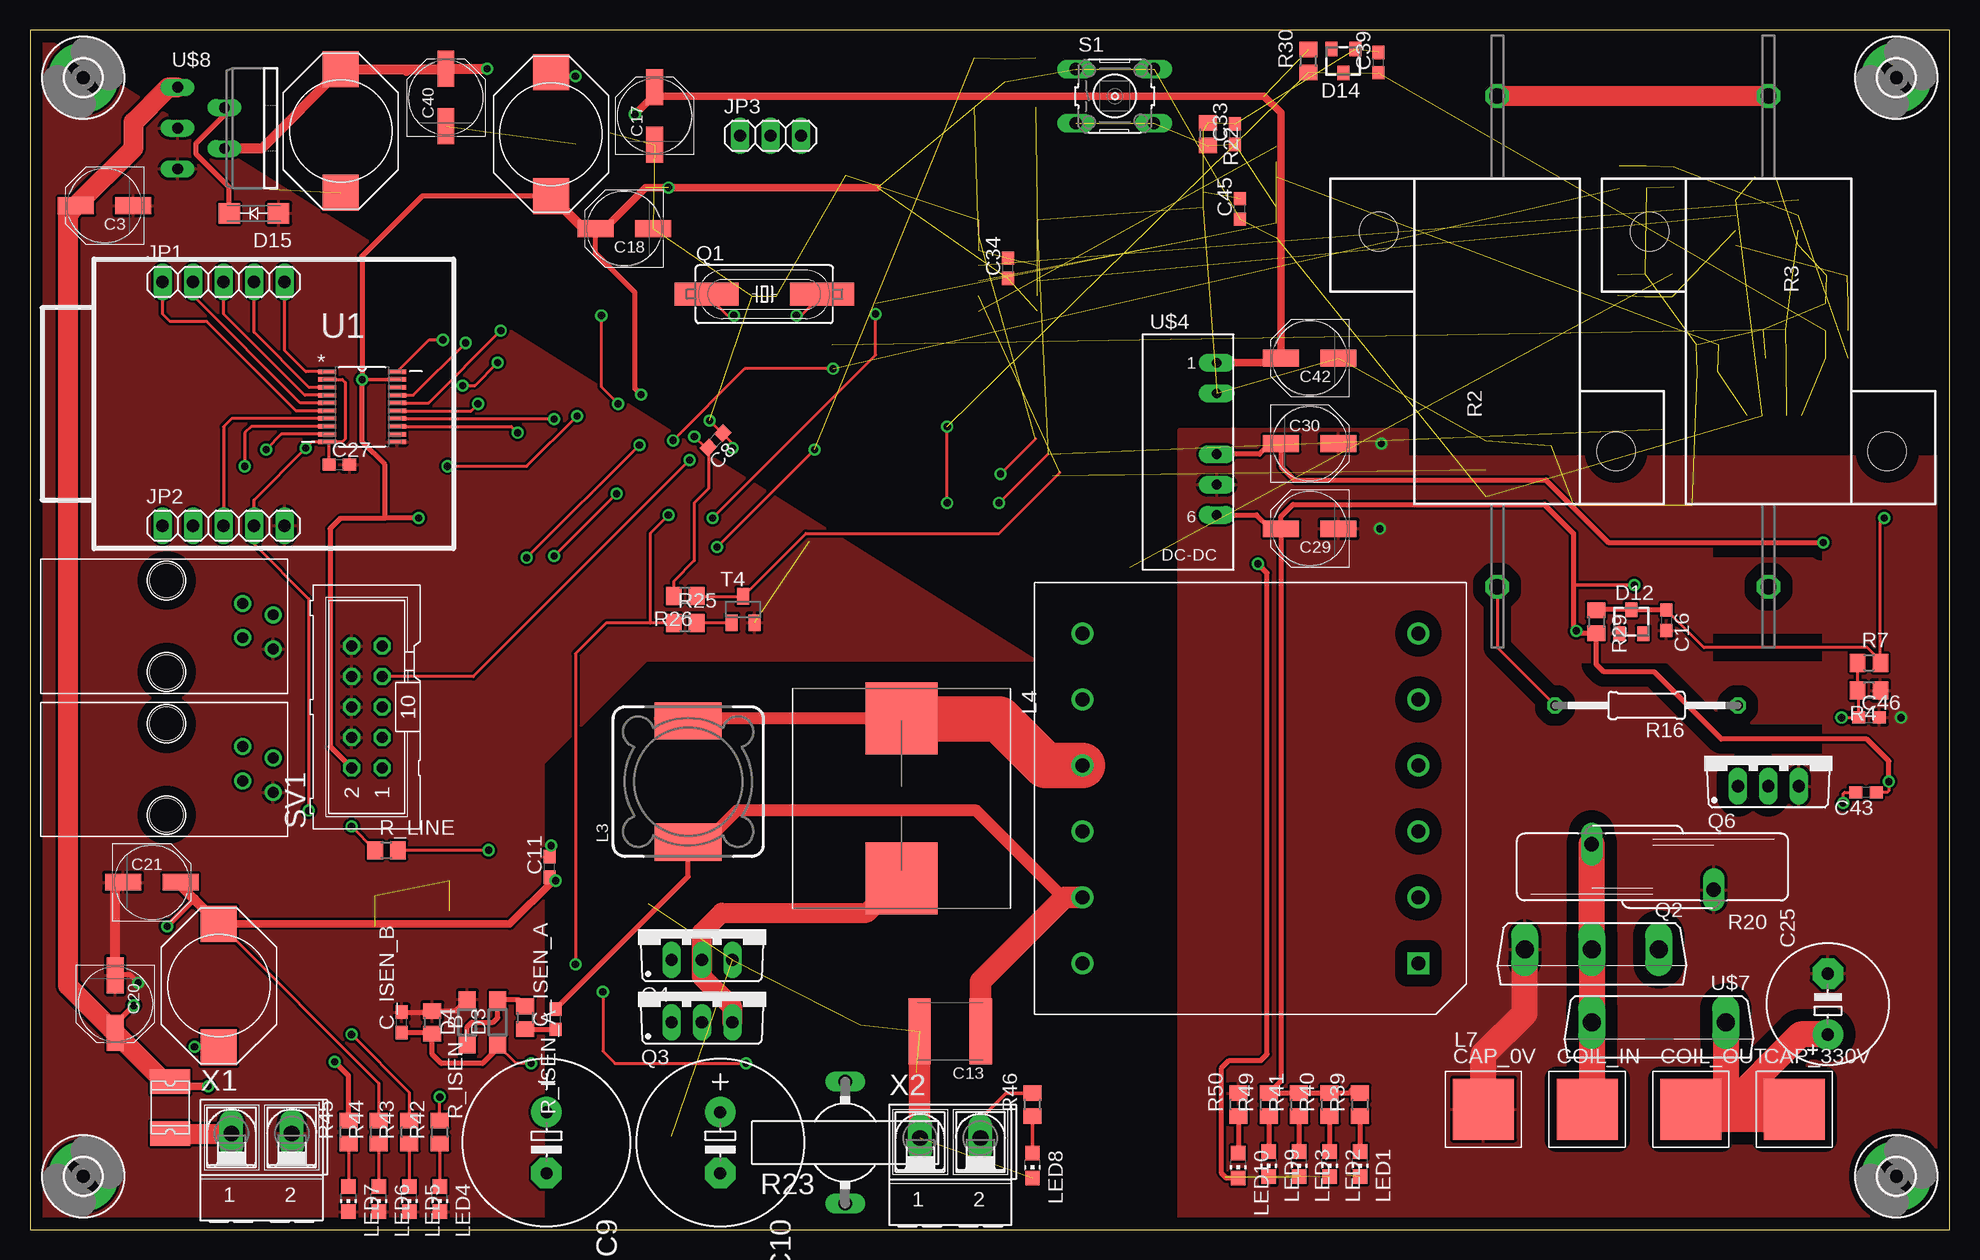
[diagram p7: board, top side]
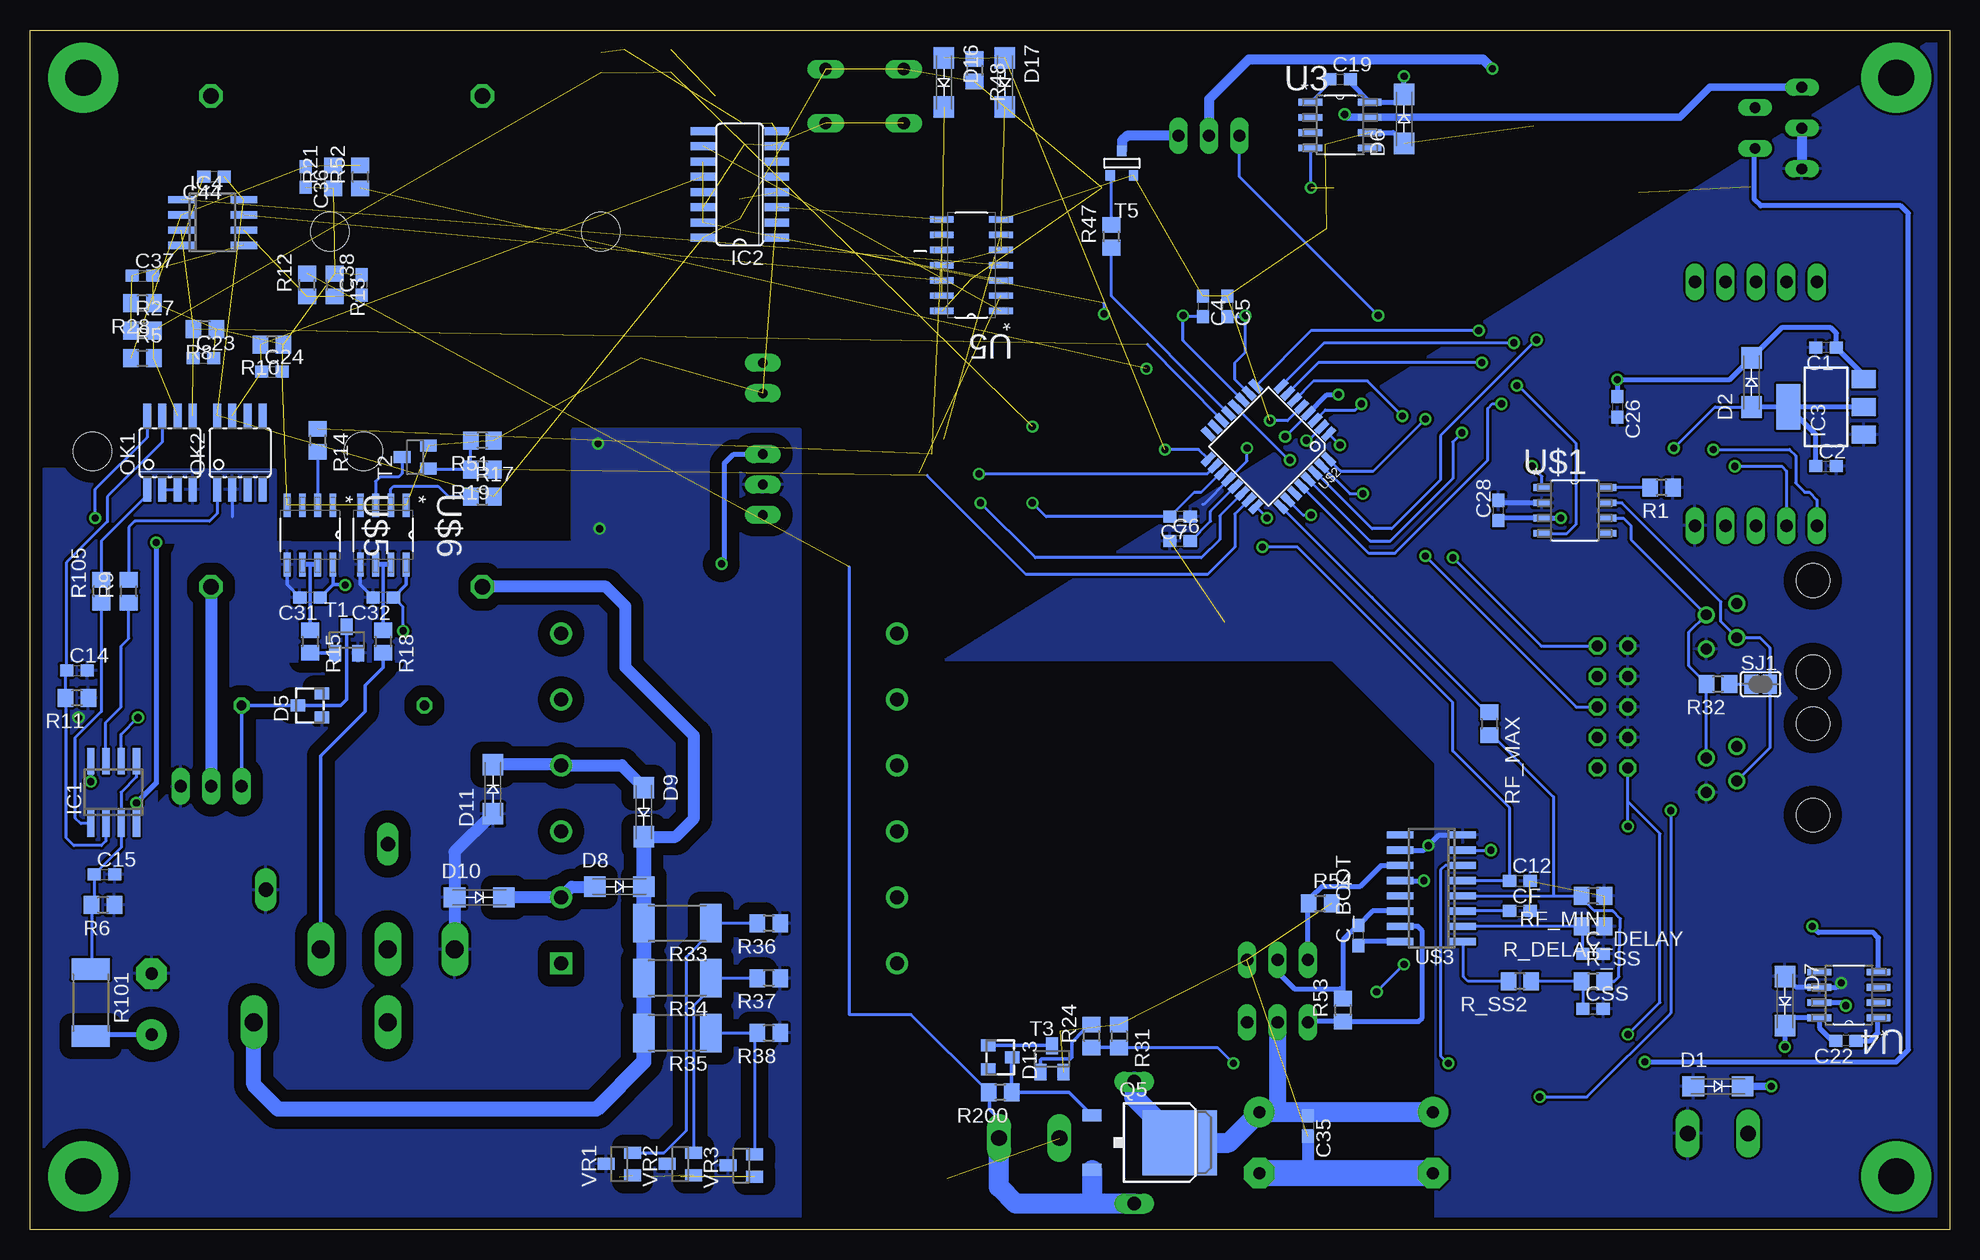
[diagram p8: board, bottom side, seen from below]

Size 160 x 100 mm. Coordinates in mm from the lower left corner, seen from the top.
Outline: 0,0 160,0 160,100 0,100 0,0
Copper layers (1*16): Top 0.035mm / dielectric 1.5mm / Bottom 0.035mm
Design rules "default": minimum track width 10mil, minimum drill 24mil, track to track 8mil, track to pad 8mil, pad to pad 8mil, via to via 8mil, smd to smd 8mil, copper to edge 40mil, drill to drill 8mil, minimum pad ring 10mil, minimum via ring 8mil, stop-mask expansion 4mil, vias tented up to drill 0mil, thermal gap 10mil

### Footprints (pad centres in the part's own frame; a part is rotated, then mirrored left to right if it is on the bottom)
C0603 = smd 1.1 x 1: 1 -0.85,0; 2 0.85,0
PANASONIC_D = smd 3 x 1.4: + 2.4,0; - -2.4,0
E5-13 = drill 1.016 pad 2.54: + -2.54,0 | drill 1.016 pad 2.54 octagon: - 2.54,0
C2220K = smd 1.85 x 5.5: 1 -2.55,0; 2 2.55,0
E5-10,5 = drill 1.016 pad 2.54: + -2.54,0 | drill 1.016 pad 2.54 octagon: - 2.54,0
5-5 = smd 5.08 x 5.08: P$1 0,0
SMA-DO214AC = smd 1.8 x 1.7: A -2.05,0; K 2.05,0
SOD123 = smd 1.4 x 1.4: A 1.9,0; C -1.9,0
TO236 = smd 1 x 1.2: A -1,-1; C 0,1; NC 1,-1
1812L = smd 2.03 x 3.3: P$1 -2.16,0; P$2 2.16,0
3,0-PAD = drill 3 pad 5.842: B3,0 0,0
SO08 = smd 0.6 x 2.2: 1 -1.905,-2.6; 2 -0.635,-2.6; 3 0.635,-2.6; 4 1.905,-2.6; 5 1.905,2.6; 6 0.635,2.6; 7 -0.635,2.6; 8 -1.905,2.6
SO16 = smd 0.66 x 2.032: 1 -4.445,-3.073; 2 -3.175,-3.073; 3 -1.905,-3.073; 4 -0.635,-3.073; 5 0.635,-3.073; 6 1.905,-3.073; 7 3.175,-3.073; 8 4.445,-3.073; 9 4.445,3.073; 10 3.175,3.073; 11 1.905,3.073; 12 0.635,3.073; 13 -0.635,3.073; 14 -1.905,3.073; 15 -3.175,3.073; 16 -4.445,3.073
SOT223 = smd 1.5 x 2: 1 -2.3,-3.15; 2 0,-3.15; 3 2.3,-3.15 | smd 3.8 x 2: 4 0,3.15
1X05 = drill 1.016 long: 1 -5.08,0; 2 -2.54,0; 3 0,0; 4 2.54,0; 5 5.08,0
1X03 = drill 1.016 long: 1 -2.54,0; 2 0,0; 3 2.54,0
PISM = smd 3 x 3: 1 -5.15,0; 2 5.15,0
SRR1210 = smd 5.6 x 3.1: 1 0,5.05; 2 0,-5.05
WE-HCI_1890 = smd 6 x 6: 1 -6.65,0; 2 6.65,0
WE-LLCR_ETD34 = drill 1.2 square: 1 -14,13.75 | drill 1.2: 2 -14,8.25; 3 -14,2.75; 4 -14,-2.75; 5 -14,-8.25; 6 -14,-13.75; 7 14,-13.75; 8 14,-8.25; 9 14,-2.75; 10 14,2.75; 11 14,8.25; 12 14,13.75
CHIP-LED0805 = smd 1.2 x 1.2: A 0,-1.05; C 0,1.05
SOIC08 = smd 0.66 x 2.032: 1 -1.905,-3.073; 2 -0.635,-3.073; 3 0.635,-3.073; 4 1.905,-3.073; 5 1.905,3.073; 6 0.635,3.073; 7 -0.635,3.073; 8 -1.905,3.073
HC49UP = smd 5.334 x 1.93: 1 -4.826,0; 2 4.826,0
TO247BV = drill 1.499 long: D 0,-2.921; G -5.588,-2.921; S 5.588,-2.921
TO220BV = drill 1.016 long: D 0,-2.54; G -2.54,-2.54; S 2.54,-2.54
D-PAK_TO252AA = smd 1 x 1.6: 1 -2.28,-4.8; 3 2.28,-4.8 | smd 5.4 x 6.2: 4 0,2.5
R0805 = smd 1.3 x 1.5: 1 -0.95,0; 2 0.95,0
HS25 = drill 1.3 octagon: 1 -20.47,0; 2 20.47,0 | hole 3.2: 9.15,9.9; -9.15,-9.9
0207/15 = drill 0.813 octagon: 1 -7.62,0; 2 7.62,0
S20K320 = drill 1.194 long: 1 -1.905,-5.08; 2 1.905,5.08
N644A = drill 1.118 long: 1 -5.08,0; 2 5.08,0
R2512 = smd 1.8 x 3.2: 1 -2.8,0; 2 2.8,0
RJ10 = drill 0.9: P$1 -1.905,6.55; P$2 -0.953,9.09; P$3 0.953,6.55; P$4 1.905,9.09 | hole 2.8: -3.81,0.2; 3.81,0.2
B3F-10XX = drill 1.016 long: 1 -3.251,2.261; 2 3.251,2.261; 3 -3.251,-2.261; 4 3.251,-2.261
SJ = smd 1.168 x 1.6: 1 -0.762,0; 2 0.762,0
ML10 = drill 0.914 octagon: 1 -5.08,-1.27; 2 -5.08,1.27; 3 -2.54,-1.27; 4 -2.54,1.27; 5 0,-1.27; 6 0,1.27; 7 2.54,-1.27; 8 2.54,1.27; 9 5.08,-1.27; 10 5.08,1.27
SOT23 = smd 1 x 1.4: 1 -0.95,-1.1; 2 0.95,-1.1; 3 0,1.1
SOT-23 = smd 0.787 x 0.889: 1 0.025,-1.016; 2 -0.94,1.016; 3 0.991,1.016
SOP65P640X120-20N = smd 1.473 x 0.356: 1 -2.921,2.921; 2 -2.921,2.286; 3 -2.921,1.626; 4 -2.921,0.965; 5 -2.921,0.33; 6 -2.921,-0.33; 7 -2.921,-0.965; 8 -2.921,-1.626; 9 -2.921,-2.286; 10 -2.921,-2.921; 11 2.921,-2.921; 12 2.921,-2.286; 13 2.921,-1.626; 14 2.921,-0.965; 15 2.921,-0.33; 16 2.921,0.33; 17 2.921,0.965; 18 2.921,1.626; 19 2.921,2.286; 20 2.921,2.921
SOIC127P620X175-8N = smd 1.981 x 0.559: 1 -2.464,1.905; 2 -2.464,0.635; 3 -2.464,-0.635; 4 -2.464,-1.905; 5 2.464,-1.905; 6 2.464,-0.635; 7 2.464,0.635; 8 2.464,1.905
SOIC127P600X175-14N = smd 1.981 x 0.533: 1 -2.464,3.81; 2 -2.464,2.54; 3 -2.464,1.27; 4 -2.464,0; 5 -2.464,-1.27; 6 -2.464,-2.54; 7 -2.464,-3.81; 8 2.464,-3.81; 9 2.464,-2.54; 10 2.464,-1.27; 11 2.464,0; 12 2.464,1.27; 13 2.464,2.54; 14 2.464,3.81
SOIC127P600X175-8N = smd 1.473 x 0.559: 1 -2.718,1.905; 2 -2.718,0.635; 3 -2.718,-0.635; 4 -2.718,-1.905; 5 2.718,-1.905; 6 2.718,-0.635; 7 2.718,0.635; 8 2.718,1.905
TQFP32-08 = smd 1.27 x 0.559: 1 -4.293,2.8; 2 -4.293,2; 3 -4.293,1.2; 4 -4.293,0.4; 5 -4.293,-0.4; 6 -4.293,-1.2; 7 -4.293,-2; 8 -4.293,-2.8; 17 4.293,-2.8; 18 4.293,-2; 19 4.293,-1.2; 20 4.293,-0.4; 21 4.293,0.4; 22 4.293,1.2; 23 4.293,2; 24 4.293,2.8 | smd 0.559 x 1.27: 9 -2.8,-4.293; 10 -2,-4.293; 11 -1.2,-4.293; 12 -0.4,-4.293; 13 0.4,-4.293; 14 1.2,-4.293; 15 2,-4.293; 16 2.8,-4.293; 25 2.8,4.293; 26 2,4.293; 27 1.2,4.293; 28 0.4,4.293; 29 -0.4,4.293; 30 -1.2,4.293; 31 -2,4.293; 32 -2.8,4.293
SO16' = smd 0.6 x 2.2: 1 -4.445,-2.6; 2 -3.175,-2.6; 3 -1.905,-2.6; 4 -0.635,-2.6; 5 0.635,-2.6; 6 1.905,-2.6; 7 3.175,-2.6; 8 4.445,-2.6; 9 4.445,2.6; 10 3.175,2.6; 11 1.905,2.6; 12 0.635,2.6; 13 -0.635,2.6; 14 -1.905,2.6; 15 -3.175,2.6; 16 -4.445,2.6
TMH-D = drill 0.8 pad 1.5 long: 1 0,6.35; 2 0,3.81; 4 0,-1.27; 5 0,-3.81; 6 0,-6.35
SOIC-8 = smd 1.981 x 0.559: 1 -2.464,1.905; 2 -2.464,0.635; 3 -2.464,-0.635; 4 -2.464,-1.905; 5 2.464,-1.905; 6 2.464,-0.635; 7 2.464,0.635; 8 2.464,1.905
TO247AD = drill 1.499 long: A 5.588,-2.921; C -5.588,-2.921
TO220511 = drill 0.9 long: 1 -3.4,-8.4; 2 -1.7,-4.5; 3 0,-8.4; 4 1.7,-4.5; 5 3.4,-8.4
AK500/2-H = drill 1.321 long: 1 -2.515,0; 2 2.515,0

### Placement (x,y rotation side)
C1  10.29,73.53 180 bottom
C2  10.29,63.63 0 bottom
C3  6.22,85.34 180 top
C4  62.23,76.96 270 bottom
C5  60.2,76.96 270 bottom
C6  64.14,57.4 0 bottom
C7  64.14,59.44 180 bottom
C8  57.15,65.79 225 top
C9  43.05,7.24 270 top
C10  57.53,7.24 270 top
C11  43.31,30.23 90 top
C12  35.81,29.08 0 bottom
C13  76.71,16.51 180 top
C14  156.08,46.61 0 bottom
C15  153.8,29.59 0 bottom
C16  136.4,50.8 270 top
C17  52.07,92.84 90 top
C18  49.53,83.44 180 top
C19  50.8,95.89 0 bottom
C20  7.11,18.8 270 top
C21  10.16,28.96 0 top
C22  8.64,15.75 180 bottom
C23  145.54,72.64 0 bottom
C24  139.83,71.5 0 bottom
C25  149.86,18.8 90 top
C26  27.69,68.58 270 bottom
C27  25.78,63.75 0 top
C28  37.59,59.94 90 bottom
C29  106.68,58.42 180 top
C30  106.68,65.53 0 top
C31  136.65,52.7 180 bottom
C32  130.56,52.7 180 bottom
C33  100.46,91.31 90 top
C34  81.53,80.14 90 top
C35  53.47,8.64 270 bottom
C36  137.03,87.76 270 bottom
C37  150.62,79.5 0 bottom
C38  132.33,78.74 90 bottom
C39  112.39,97.28 90 top
C40  34.67,94.36 90 top
C42  106.68,72.64 180 top
C43  153.03,36.45 180 top
C44  144.65,87.76 180 bottom
C45  100.84,85.09 90 top
C46  153.29,42.67 0 top
C_BOOT  49.28,24.51 90 bottom
C_DELAY  29.72,22.99 0 bottom
C_ISEN_A  43.81,17.53 90 top
C_ISEN_B  30.99,17.27 90 top
CAP_0V  121.16,10.03 270 top
CAP_330V  147.07,10.03 270 top
CF  35.81,26.54 0 bottom
COIL_IN  129.79,10.03 270 top
COIL_OUT  138.43,10.03 270 top
CSS  29.72,18.41 0 bottom
D1  19.3,11.94 0 bottom
D2  16.51,70.61 90 bottom
D3  38.99,17.27 90 top
D4  36.45,17.27 90 top
D5  136.65,43.69 90 bottom
D6  45.47,92.58 90 bottom
D7  13.72,19.05 270 bottom
D8  110.87,28.57 0 bottom
D9  108.84,34.8 270 bottom
D10  122.56,27.69 0 bottom
D11  121.41,36.7 90 bottom
D12  133.48,50.67 0 top
D13  79.12,14.35 270 bottom
D14  109.47,97.41 180 top
D15  18.67,84.71 180 top
D16  83.82,95.63 270 bottom
D17  78.74,95.63 270 bottom
F1  11.68,10.16 270 top
H1  155.57,4.45 0 top
H2  155.57,96.01 0 top
H3  4.45,96.01 0 top
H4  4.45,4.45 0 top
IC1  153.03,36.45 0 bottom
IC2  100.84,87.12 90 bottom
IC3  10.29,68.58 90 bottom
IC4  144.78,83.95 270 bottom
JP1  16.13,78.99 0 top
JP2  16.13,58.67 0 top
JP3  61.72,91.19 0 top
L1  25.91,91.57 270 top
L3  54.86,37.34 0 top
L4  72.64,35.94 270 top
L5  43.43,91.31 90 top
L6  15.75,20.32 270 top
L7  101.73,35.94 180 top
LED1  110.87,5.46 180 top
LED2  108.33,5.46 180 top
LED3  105.79,5.46 180 top
LED4  34.16,2.54 180 top
LED5  31.62,2.54 180 top
LED6  29.08,2.54 180 top
LED7  26.54,2.54 180 top
LED8  83.57,5.33 180 top
LED9  103.25,5.46 180 top
LED10  100.71,5.33 180 top
OK1  148.34,64.77 0 bottom
OK2  142.49,64.77 0 bottom
Q1  61.21,77.98 0 top
Q2  130.18,20.45 180 top
Q3  56.01,19.81 0 top
Q4  56.01,25.02 0 top
Q5  66.67,7.24 270 bottom
Q6  144.91,39.5 0 top
R1  24,61.85 180 bottom
R2  122.3,74.04 90 top
R3  144.91,74.04 270 top
R4  153.29,44.96 180 top
R5  150.62,72.64 0 bottom
R6  153.92,27.05 180 bottom
R7  153.29,47.24 0 top
R8  145.41,75.06 180 bottom
R9  151.76,53.21 90 bottom
R10  139.83,73.79 180 bottom
R11  156.08,44.32 180 bottom
R12  136.91,78.74 90 bottom
R13  134.62,78.74 270 bottom
R14  136.02,65.79 270 bottom
R15  136.65,49.02 270 bottom
R16  134.75,43.69 180 top
R17  122.3,61.09 0 bottom
R18  130.56,49.02 270 bottom
R19  122.3,63.37 180 bottom
R20  135.25,30.23 90 top
R21  134.75,87.76 90 bottom
R22  98.17,91.31 270 top
R23  67.94,7.24 90 top
R24  71.5,16.13 90 bottom
R25  54.61,50.55 0 top
R26  54.61,52.83 180 top
R27  150.62,74.93 0 bottom
R28  150.62,77.22 180 bottom
R29  130.56,50.67 270 top
R30  106.55,97.41 90 top
R31  69.22,16.13 270 bottom
R32  19.3,45.47 180 bottom
R33  106.05,25.53 180 bottom
R34  106.05,20.95 180 bottom
R35  106.05,16.38 180 bottom
R36  98.42,25.53 180 bottom
R37  98.42,20.95 180 bottom
R38  98.42,16.38 180 bottom
R39  110.87,10.41 90 top
R40  108.33,10.41 90 top
R41  105.79,10.41 90 top
R42  34.16,8.13 90 top
R43  31.62,8.13 90 top
R44  29.08,8.13 90 top
R45  26.54,8.13 90 top
R46  83.57,10.41 90 top
R47  69.85,82.8 90 bottom
R48  81.28,96.65 270 bottom
R49  103.25,10.41 90 top
R50  100.71,10.41 90 top
R51  122.3,65.79 180 bottom
R52  132.46,87.76 90 bottom
R53  50.55,18.29 90 bottom
R54  52.45,27.18 0 bottom
R101  154.94,18.92 270 bottom
R105  154.05,53.21 90 bottom
R200  79.12,11.43 180 bottom
R_DELAY  29.72,25.27 180 bottom
R_ISEN_A  41.27,17.65 270 top
R_ISEN_B  33.53,17.27 270 top
R_LINE  29.72,31.62 0 top
R_SS  29.72,20.7 0 bottom
R_SS2  35.81,20.7 180 bottom
RF_MAX  38.35,42.16 270 bottom
RF_MIN  29.72,27.81 180 bottom
RJ_1  11.18,38.35 270 top
RJ_2  11.18,50.29 270 top
S1  90.42,94.49 0 top
SJ1  15.75,45.47 0 bottom
SV1  28.07,43.56 90 top
T1  133.6,49.15 0 bottom
T2  127.89,64.39 90 bottom
T3  74.8,14.22 0 bottom
T4  59.44,51.69 0 top
T5  68.96,88.9 180 bottom
U1  27.69,68.58 0 top
U3  50.8,92.08 0 bottom
U4  8.38,19.56 180 bottom
U5  81.53,80.39 180 bottom
U$1  31.24,59.94 0 bottom
U$2  56.77,65.28 225 bottom
U$3  L6599  [SO16']  43.18,28.45 90 bottom
U$4  98.93,65.91 0 top
U$5  136.65,57.91 270 bottom
U$6  130.56,57.91 270 bottom
U$7  135.76,14.35 180 top
U$8  20.7,91.82 270 top
VR1  110.87,5.46 90 bottom
VR2  105.79,5.46 90 bottom
VR3  100.71,5.33 90 bottom
X1  19.3,8 0 top
X2  76.71,7.62 0 top

### Tracks (layer width: path | path; a pad name or v marks a point on that pad's centre or on a via)
1.25V-BIS-6V  (via drill 0.6)
  Top 0.254: v38.23,31.62 R_LINE.2
  Bottom 0.254: U$3.7 v38.23,31.62
+3V3  (via drill 0.6)
  Top 0.254: U1.2 26.04,70.87 26.29,70.61 26.29,65.91 26.04,65.66 U1.10 | v23.24,34.92 23.24,52.58 18.67,57.15 JP2.4 18.67,60.83 v22.99,65.15 23.5,65.66 U1.10 | R42.2 v34.16,11.05 | C27.1 24.93,65.49 U1.10
  Bottom 0.254: v23.24,34.92 23.24,18.03 30.23,11.05 v34.16,11.05 | v22.99,65.15 19.56,68.58 16.53,68.58 D2.A
  Bottom 0.406: IC3.2 IC3.4 | IC3.4 16.49,68.58 D2.A | C2.1 11.14,66.28 IC3.4
+5V  (via drill 0.6)  (12 unrouted)
  Top 0.254: v26.8,16.26 31.62,11.43 R43.2 | R_LINE.1 v26.8,33.59 | v55.37,66.11 56.3,65.19 C8.2 56.55,61.76 55.37,60.58 55.37,55.75 53.66,54.04 R26.2
  Top 0.305: U1.19 v27.69,70.87
  Top 0.406: 43.43,86.23 L5.1 32.7,86.16 27.69,81.15 v27.69,70.87 27.69,65.66 29.59,63.75 29.59,59.31 | v50.93,69.6 50.42,70.1 50.42,78.11 47.13,81.39 C18.+ | v32.38,59.31 29.59,59.31 | SV1.2 25.02,40.26 25.02,58.42 25.91,59.31 29.59,59.31
  Top 0.61: C18.+ 47.88,83.44 51.31,86.87 70.64,86.87
  Top 0.813: C18.+ 46.16,83.44 L5.1
  Bottom 0.254: v53.21,86.87 53.21,90.12 U3.4 | v26.8,16.26 24.13,18.92 24.13,33.02 26.8,35.69 | 26.8,35.69 SV1.2 | v26.8,33.59 26.8,35.69 | U$2.4 v55.37,66.11
  Bottom 0.406: IC3.3 7.14,71.23 C1.1 9.44,74.72 9.91,75.18 13.99,75.18 D2.K 18.31,70.87 v27.69,70.87 C26.1 | 37.88,59.09 C28.1 37.38,59.31 U$1.3 v32.38,59.31 | U$2.4 51.88,69.6 v50.93,69.6
+5V/1  (via drill 0.6)
  Top 0.406: R45.2 26.54,12.83 v25.4,13.97
  Top 0.813: U$8.4 19.31,90.12 L1.1 31.24,96.72 | 31.24,96.72 34.63,96.72 C40.+ 38.09,96.76 v38.1,96.77 | 31.37,96.59 31.24,96.72
  Bottom 0.406: v25.4,13.97 4.45,13.97 3.43,14.99 3.43,84.71 4.06,85.34 15.75,85.34 16.26,85.85 16.26,90.07 U$8.4
  Bottom 0.813: v38.1,96.77 38.86,97.54 58.42,97.54 61.72,94.23 JP3.2
+5V/3  (via drill 0.6)  (6 unrouted)
  Top 0.254: v76.45,60.58 v76.45,66.93
  Bottom 0.254: U$2.19 60.73,63.09 62.36,61.47 62.95,61.47 C7.2 75.31,59.44 v76.45,60.58
+5V/4  (via drill 0.6)
  Top 0.254: C16.1 139.53,48.51 153.16,48.51 154.24,47.44 R7.2 154.24,58.99 v154.56,59.31
  Top 0.406: C16.1 133.48,51.65 D12.C 130.56,51.67 R29.1
  Bottom 0.254: OK1.8 150.24,66.04 154.56,61.72 v154.56,59.31
+12V  (via drill 0.6)
  Top 0.254: L6.1 15.8,25.47 29.08,12.19 R44.2
  Top 0.406: v11.43,25.27 13.69,27.53 | v43.81,29.08 43.6,29.08 C11.1
  Top 0.61: 43.6,29.08 39.99,25.47 L6.1
  Top 0.813: C21.+ 12.56,28.66 13.69,27.53 L6.1
  Bottom 0.406: U4.4 5.92,24.33 6.35,24.77 10.92,24.77 v11.43,25.27 | U$3.12 v43.81,29.08
+24V  (via drill 0.6)  (1 unrouted)
  Top 0.305: 52.2,94.49 52.07,94.61
  Top 0.406: v8.64,18.67 6.74,16.77
  Top 0.61: v14.86,11.94 12.07,11.94 F1.P$1 | v50.42,92.96 52.07,94.61 C17.+ | 52.2,94.49 102.87,94.49 104.27,93.09 104.27,72.66 C42.+ 103.9,72.26 U$4.1
  Top 1.676: F1.P$1 11.19,12.32 C20.+ 6.74,16.77 3.17,20.33 3.17,84.7 C3.+ 8.64,90.16 8.64,92.33 11.53,95.22 U$8.1
  Bottom 0.406: U4.7 8.89,18.92 v8.64,18.67
  Bottom 0.61: D1.K v14.86,11.94 | U$8.1 19.97,95.22 22.48,92.71 U3.7 50.16,92.71 v50.42,92.96
ACTIVATE_BOOSTER  (via drill 0.6)
  Top 0.254: v53.21,59.56 51.69,58.04 51.69,50.55 | R25.1 51.69,50.55 | 51.69,50.55 48.01,50.55 45.47,48.01 v45.47,22.1 | v47.75,19.81 47.75,14.86 48.77,13.84 v59.69,13.84
  Bottom 0.254: U$2.26 53.88,59.56 v53.21,59.56 | v45.47,22.1 v47.75,19.81 | R31.2 61.03,15.18 v59.69,13.84
  Bottom 0.305: R24.1 R31.2
ACTIVATE_SERVO
  Bottom 0.254: U$2.13 69.85,77.79 R47.1
ADC1/SCK_A  (via drill 0.6)
  Top 0.254: SV1.7 36.96,46.1 v54.99,64.14
  Bottom 0.254: U$2.12 55.06,64.14 v54.99,64.14
ADC_CAP  (4 unrouted)
  Bottom 0.254: U$2.14 66.85,73.79
BOOSTER_24V  (1 unrouted)
  Top 0.305: R46.2 81.34,11.36 79.22,9.25 X2.2
  Bottom 0.254: R200.2 86.55,17.91 91.69,17.91 91.69,55.24
  Bottom 0.305: X2.2 79.22,9.25 80.01,10.03 80.01,11.37 R200.2
  Bottom 1.676: R23.1 71.5,2.16 | 71.5,2.16 77.85,2.16 79.25,3.56 79.25,7.59 X2.2 | Q5.3 71.47,2.19 71.5,2.16
BURST  (via drill 0.6)  (2 unrouted)
  Top 0.254: 83.82,65.91 v80.9,62.99
  Bottom 0.254: U$2.18 61.88,62.99 v80.9,62.99
CAN_H
  Bottom 0.254: RJ_1.P$3 14.99,40.14 SJ1.2 14.99,48.51 15.81,49.34 RJ_2.P$3 19.05,50.67 19.05,52.32 27.3,60.58 U$1.7
CAN_L
  Bottom 0.254: RJ_1.P$2 20.27,45.45 R32.2 20.25,45.53 21.72,46.99 21.72,49.79 RJ_2.P$2 26.54,57.52 26.54,58.67 27.18,59.31 U$1.6
CAN_RX  (via drill 0.6)
  Top 0.254: v36.07,70.36 37.08,70.36 v38.99,72.26
  Bottom 0.254: U$1.4 31.88,58.04 31.11,58.8 31.11,65.53 35.94,70.36 v36.07,70.36 | v38.99,72.26 52.61,72.26 U$2.7
CAN_TX  (via drill 0.6)
  Top 0.254: v34.8,63.63 41.4,63.63 v45.59,67.82
  Bottom 0.254: U$1.1 33.96,62.79 v34.8,63.63 | v45.59,67.82 48.51,70.74 53.01,70.74 U$2.6
CAP_0V  (via drill 0.6)
  Top 2.184: CAP_0V.P$1 121.16,14.61 124.59,18.03 Q2.S
  Bottom 0.254: OK2.2 143.13,59.44
  Bottom 0.305: U$5.5 138.56,53.76 C31.2 | U$6.5 132.46,53.76 C32.2
  Bottom 1.016: D11.A 124.61,31.46 D10.A 124.59,27.67 Q2.S
  other vias: 112.65,65.53 112.52,58.42 155.96,42.67
  pour Top (isolate 1.016): 160.02,64.39 160.02,0 95.76,0 95.76,66.67 114.81,66.67 114.81,64.39
  pour Bottom (isolate 1.016): 160.02,63.37 160.02,0 95.76,0 95.76,66.67 114.81,66.67 114.81,57.28 139.57,57.28 139.57,63.37
  pour Top: 95.76,66.67 95.76,2.16 113.03,2.16 113.03,15.62 106.43,15.62 106.43,53.59 114.81,53.59 114.81,57.28 126.24,57.28 126.24,47.37 140.21,47.37 140.21,57.28 149.48,57.28 149.48,19.18 160.02,19.18 160.02,64.39 114.81,64.39 114.81,66.67
  pour Bottom: 149.48,57.28 149.48,19.18 160.02,19.18 160.02,63.37 139.57,63.37 139.57,57.28 126.24,57.28 126.24,47.37 140.21,47.37 140.21,57.28
CAP_330V
  Top 0.254: R2.1 122.3,48.51 R16.2
  Top 2.184: U$7.C 141.35,10.16 | C25.+ 147.57,16.26 141.35,10.03
  Top 2.54: 141.35,10.16 141.48,10.03
  Top 3.81: COIL_OUT.P$1 141.35,10.03 141.48,10.03 CAP_330V.P$1
  Bottom 0.406: R101.2 154.81,16.26 C25.+
  Bottom 1.016: D9.K 106.19,32.75 104.65,34.29 104.65,41.15 110.36,46.86 110.36,51.94 112.01,53.59 122.28,53.59 R2.1
  Bottom 1.27: D9.K 108.84,28.59 D8.K 108.84,28.55 R33.2 | 108.82,25.55 R33.2 | R33.2 R34.2 R35.2 108.84,13.96 112.78,10.03 139.32,10.03 141.35,12.06 U$7.C
CAP_+12V  (via drill 0.6)
  Top 0.254: v154.94,37.34 154.94,36.58 154.81,36.45 C43.1
  Top 0.305: v133.73,53.72 128.78,53.72 128.65,53.85
  Top 0.406: R39.2 110.36,11.36 | 110.36,11.36 R40.2 R41.2 R49.2 104.28,12.39 C29.+ | 110.11,11.62 110.36,11.36 | U$4.6 102.23,59.56 103.25,58.55 104.15,58.55 C29.+ | C29.+ 104.28,59.45 105.28,60.45 126.24,60.45 128.65,58.04 128.65,53.85 128.65,50.16 v128.91,49.91 129.09,49.72 R29.2 130.56,47.12 131.19,46.48 135.38,46.48 140.97,40.89 153.09,40.89 IC1.8 v154.94,37.34
  Bottom 0.254: v128.91,49.91 128.91,51.9 C32.1
  Bottom 0.305: U$5.8 134.75,53.76 | 134.75,53.76 C31.1 | U$6.8 128.65,53.76 C32.1 | 134.75,53.76 133.77,53.76 v133.73,53.72
  Bottom 0.406: IC1.8 v154.94,37.34
CAP_-12V  (via drill 0.6)
  Top 0.254: v151.13,35.56 151.13,36.32 151.26,36.45 C43.2
  Top 0.406: LED10.C 99.73,4.28 99.31,4.7 99.31,13.46 99.95,14.1 102.62,14.1 103.12,14.61 103.12,54.74 v102.36,55.5 | U$4.4 102.49,64.64 103.38,65.53 C30.- 104.28,63.61 105.41,62.48 126.36,62.48 131.57,57.28 v149.48,57.28
  Bottom 0.254: IC1.4 v151.13,35.56
  Bottom 0.406: v149.48,57.28 149.48,37.21 v151.13,35.56 | v102.36,55.5 102.11,55.75 102.11,63.88 101.35,64.64 U$4.4
CLKOUT_ETH_3V  (via drill 0.6)
  Top 0.254: U1.9 20.95,66.29 v19.68,65.02
  Bottom 0.254: v19.68,65.02 13.34,65.02 12.83,64.52 12.83,62.23 12.06,61.47 11.68,61.47 11.05,60.83 JP2.1
CS_ETH  (via drill 0.6)
  Top 0.254: U1.13 40.11,66.95 v40.64,66.42
  Bottom 0.254: U$2.29 48.31,57.4 46.61,57.4 41.4,62.61 41.4,65.66 v40.64,66.42
CS_ETH_3V  (via drill 0.6)
  Top 0.254: U1.8 18.44,66.95 17.91,66.42 v17.91,63.63
  Bottom 0.254: v17.91,63.63 13.97,63.63 13.59,63.25 JP2.2
D2A/RF_MAX
  Bottom 0.254: U$2.25 48.16,52.7 48.13,52.7 38.54,43.11 RF_MAX.1
GND  (via drill 0.6)  (48 unrouted)
  Top 0.254: v58.55,65.15 58.55,65.53 57.75,66.33 C8.1 57.69,66.39 v56.64,67.44
  Top 0.406: v9.02,20.57 8.38,21.21 7.12,21.21 C20.- | D4.A 35.5,18.22 R_ISEN_B.1 33.43,18.12 C_ISEN_B.2 | C11.2 43.31,31.88 v43.43,32
  Top 0.813: C20.- 7.11,28.31 C21.-
  Bottom 0.254: 54.09,68.6 U$2.5 55.18,67.44 v56.64,67.44 | 63.18,59.44 C7.1 | 64.98,57.74 C6.1 | v58.55,65.15 58.55,64.07 U$2.20 62.16,60.45 62.23,60.45
  Bottom 0.406: D7.A 12.81,20.19 U4.6 9.4,20.19 v9.02,20.57 | U$1.2 37.38,60.58 C28.2 | U$3.10 43.81,31.62 v43.43,32 42.55,32.89 U$3.8 | U3.6 46.37,91.44 D6.A
  Bottom 0.813: U$8.3 U$8.5
  pour Bottom: 0,0 42.8,0 42.8,38.86 51.44,47.5 83.69,47.5 0,100.08
  pour Top: 0,0 42.8,0 42.8,38.86 51.44,47.5 83.69,47.5 0,100.08
GND1  (6 unrouted)
  Top 1.778: C13.2 74.16,7.66 X2.1
  Bottom 1.016: C35.2 53.47,4.83 53.59,4.7
  Bottom 2.184: C9.- 53.59,4.7 C10.-
INT_ETH  (via drill 0.6)
  Top 0.254: U1.20 33.27,74.17 v34.42,74.17
  Bottom 0.254: v34.42,74.17 42.42,66.17 42.42,62.48 46.48,58.42 48.13,58.42 52.84,63.13 U$2.30
INT_ETH_3V
  Top 0.254: U1.1 22.99,71.5 21.21,73.28 JP1.5
KICK  (1 unrouted)
  Bottom 0.254: U$2.23 59.56,59.66 59.56,56.9 61.85,54.61 76.96,54.61 85.22,62.87
KICK_VOLTAGE  (4 unrouted)
MISO  (via drill 0.6)
  Top 0.254: U1.17 31.95,69.55 v36.32,73.91
  Bottom 0.254: v36.32,73.91 52.15,73.91 U$2.8
MISO_3V
  Top 0.254: U1.4 22.91,69.55 16.13,76.33 JP1.3
MOSI  (via drill 0.6)
  Top 0.254: U1.16 33.22,68.91 v39.24,74.93
  Bottom 0.254: v39.24,74.93 53.24,74.93 U$2.9
MOSI_3V
  Top 0.254: U1.5 22.53,68.91 13.59,77.85 JP1.2
N$1  (via drill 0.6)
  Top 0.406: v45.47,96.14 43.76,96.14 L5.2
  Bottom 0.406: C19.2 49.95,95.59 U3.8 46.12,93.98 D6.K v45.47,96.14
N$2  (1 unrouted)
N$3
  Bottom 0.254: C19.1 51.65,95.59 U3.1
N$4
  Bottom 0.254: R1.2 U$1.8
N$5  (via drill 0.6)
  Top 0.254: v63.88,76.2 64.26,76.2 Q1.2
  Bottom 0.254: C4.2 63.79,76.11 v63.88,76.2 63.88,74.11 U$2.11
N$6  (via drill 0.6)
  Top 0.254: v58.67,76.2 58.17,76.2 Q1.1
  Bottom 0.254: C5.2 58.76,76.11 v58.67,76.2 58.67,73.15 59.56,72.26 59.56,70.87 58.46,69.77 U$2.10
N$7
  Bottom 0.254: R_SS2.1 R_SS.1 30.57,20.6 CSS.1
N$8
  Bottom 0.254: R_SS.2 27.94,20.7 27.56,21.08 27.43,25.91 28.07,26.54 29.59,26.54 30.35,27.3 30.35,27.5 RF_MIN.2 33.02,27.81 | U$3.4 33.02,27.81 | RF_MAX.2 38.17,41.21 33.02,36.07 33.02,27.81
N$9
  Bottom 0.254: R32.1 SJ1.1
N$10
  Bottom 0.254: C6.2 63.25,57.4 61.59,59.05 61.59,59.89 U$2.21
N$11
  Bottom 0.254: CF.1 U$3.3
N$12
  Bottom 0.254: 99.31,25.47 R36.2 R33.1 103.25,24.77 105.28,22.73 105.28,8.26 107.13,6.41 VR1.2
N$13
  Bottom 0.254: R105.1 154.05,43.18 156.21,41.02 156.21,34.29 155.77,33.85 IC1.1
N$14
  Bottom 0.254: IC1.2 153.67,32.38 154.05,32 156.34,32 156.97,32.64 156.97,44.26 R11.2 157.03,46.51 C14.1 156.93,55.63 153.54,59.02 153.54,61.09 148.97,65.66 OK1.7
N$15
  Bottom 0.254: IC1.5 151.13,37.72 152.4,36.45 IC1.3 152.4,31.84 C15.1 154.65,27.28 R6.2 154.87,21.79 R101.1
N$16
  Bottom 0.406: Q3.G 53.4,17.34 R53.1 44.26,17.34 43.94,17.65 43.94,24.89 44.32,25.27 U$3.15
N$17
  Bottom 0.406: U$3.11 47.37,30.35 49.15,28.57 52.32,28.57 53.21,27.69 53.21,27.37 R54.1 53.47,27.11 Q4.G
N$18
  Bottom 0.254: R_SS2.2 40.13,20.7 40.51,21.08 40.51,23.94 U$3.1
N$19
  Bottom 0.406: U$3.16 48.93,24 C_BOOT.1
N$20
  Bottom 0.254: C_DELAY.1 30.57,25.17 R_DELAY.2 U$3.2
N$21
  Bottom 0.254: OK1.1 150.24,61.21 154.05,57.4 R105.2
N$22
  Bottom 0.254: OK1.2 OK1.3
N$23
  Top 1.676: R2.2 R3.1
N$24
  Bottom 1.016: R3.2 Q6.D
N$25
  Bottom 0.254: IC1.7 153.67,42.29 152.4,43.56 152.4,48.64 151.76,49.28 R9.1
N$26  (via drill 0.6)
  Top 0.406: v13.72,15.24 15.68,15.24 L6.2
  Bottom 0.406: C22.2 9.78,15.75 10.79,16.76 10.79,17.6 U4.8 13.06,17.65 D7.K v13.72,15.24
N$27  (via drill 0.6)
  Top 0.254: v151,42.67 C46.1 152.44,44.86 R4.2 R7.1
  Bottom 0.254: IC1.6 152.4,41.27 v151,42.67
N$28  (via drill 0.6)
  Top 0.254: v41.78,13.84 40.52,13.84 D3.C
  Top 0.406: D3.C 38.99,15.11 37.72,13.84 34.29,13.84 33.53,14.61 R_ISEN_B.2 33.43,16.42 C_ISEN_B.1
  Bottom 0.254: U$3.6 42.04,30.35 42.42,29.97 42.42,14.48 v41.78,13.84
N$29
  Top 1.016: L4.1 52.5,42.59 L3.1
  Top 3.81: L7.9 84.63,38.69 80.77,42.55 72.69,42.55 L4.1
N$30
  Top 1.676: F1.P$2 X1.1
N$31
  Top 0.406: R_ISEN_A.1 40.71,19.17 D3.A 38.99,17.65 38.61,17.27 36.83,17.27 36.45,16.89 D4.C
N$32
  Top 0.406: R_ISEN_A.2 43.79,16.7 C_ISEN_A.1
N$33
  Bottom 0.406: C22.1 6.6,15.75 5.97,16.38 5.97,17.6 U4.1
N$34
  Bottom 1.016: D10.K L7.2 114.84,28.57 D8.A
N$35
  Bottom 0.254: R9.2 151.76,58.55 151.26,59.05 145.03,59.05 144.4,59.69 OK2.1
N$36
  Bottom 1.016: D9.A 110.68,38.69 L7.4 115.79,38.75 D11.K
N$37  (1 unrouted)
N$38  (1 unrouted)
N$39  (3 unrouted)
N$40
  Bottom 0.254: R14.2 U$5.2
N$41
  Bottom 0.305: R15.1 136.65,55.32 136.53,55.45
  Bottom 0.406: U$5.7 136.53,55.45 U$5.6
N$42
  Bottom 0.254: T2.3 128.99,63.03 129.29,62.74 130.81,62.74 131.19,62.36 U$6.3
N$43
  Bottom 0.254: U$6.2 129.92,61.72 129.67,61.98 125.98,61.98 125.09,61.09 R17.1
N$44
  Bottom 0.305: R18.1 130.56,55.32 130.43,55.45
  Bottom 0.406: U$6.7 130.43,55.45 U$6.6
N$45
  Bottom 0.305: T1.3 133.6,44.2 134.11,43.69 D5.C R16.1 Q6.G
N$46
  Bottom 0.305: R15.2 134.58,48.07 T1.1
N$47
  Bottom 0.254: T2.1 126.72,63.37 R19.2 R51.2
N$48
  Bottom 0.305: Q2.G 135.76,39.5 132.08,43.18 132.08,45.34 130.56,46.86 R18.2
N$49
  Top 2.184: COIL_IN.P$1 130.18,10.41 U$7.A Q2.D R20.2
N$50  (1 unrouted)
N$52
  Top 0.254: R25.2 55.6,50.59 T4.1
N$53  (1 unrouted)
N$54
  Bottom 0.305: D13.C 78.17,14.3 R200.1 73.39,11.43 Q5.1
N$55
  Bottom 0.305: T3.3 74.83,15.35 D13.A
N$56
  Bottom 0.305: T3.1 75.75,14.16 75.69,14.22 73.28,14.22 73.15,14.35 73.15,15.62 72.14,16.64 71.94,16.64 R24.2
N$57
  Bottom 1.016: C35.1 57.24,9.49 C10.+
  Bottom 1.422: Q3.D 56.01,10.03 55.75,9.78
  Bottom 1.676: C9.+ 55.75,9.78 C10.+ 60.07,7.24 Q5.4 67.94,11.01 R23.2
N$58  (1 unrouted)
  Top 0.254: 85.85,63.12 80.77,58.04 64.69,58.04 T4.3 55.6,52.79 R26.1
N$59  (3 unrouted)
N$60
  Bottom 0.254: R37.2 R34.1 103.25,20.07 104.65,18.67 104.65,6.45 VR2.2
N$61
  Bottom 0.254: R35.1 R38.2 99.61,16.15 VR3.2
N$62  (1 unrouted)
N$63  (1 unrouted)
N$64
  Top 0.406: R39.1 LED1.A
N$65
  Top 0.406: R40.1 LED2.A
N$66
  Top 0.406: R41.1 LED3.A
N$67
  Top 0.254: R42.1 LED4.A
N$69  (1 unrouted)
  Top 0.406: D15.K 16.62,86.89 13.84,89.66 13.84,90.55 16.26,92.96 16.26,93.47 U$8.2
N$70
  Bottom 0.813: JP3.3 68.58,91.19 68.96,90.81 68.96,89.94 T5.1
N$71
  Top 0.254: R45.1 LED7.A
N$72
  Top 0.254: R43.1 LED5.A
N$73
  Top 0.254: R44.1 LED6.A
N$74
  Top 0.305: R46.1 LED8.A
N$75
  Bottom 0.254: R47.2 69.85,87.78 T5.3
N$76
  Top 0.406: R49.1 LED9.A
N$77
  Top 0.406: R50.1 LED10.A
NOTAUS  (via drill 0.6)  (3 unrouted)
  Top 0.254: v80.77,60.58 84.84,64.64
  Bottom 0.254: U$2.22 60.83,59.52 60.83,57.53 62.36,56.01 76.2,56.01 v80.77,60.58
OC0A/MOSI_A/KICK_VOLTAGE  (via drill 0.6)  (1 unrouted)
  Top 0.254: v53.59,65.79 59.56,71.75 v66.93,71.75
  Bottom 0.254: U$2.2 53.43,65.79 v53.59,65.79
OC1A/MISO_A  (via drill 0.6)
  Top 0.254: v50.8,65.41 v41.4,56.01
  Bottom 0.254: U$2.1 v50.8,65.41 | v41.4,56.01 34.04,48.64 SV1.9
RESET_NOTAUS  (via drill 0.6)  (2 unrouted)
  Top 0.254: v56.9,59.31 70.48,72.9 v70.48,76.33
  Bottom 0.254: U$2.24 56.9,59.33 v56.9,59.31 | 70.48,77.22 v70.48,76.33
RST  (via drill 0.6)
  Top 0.254: v48.9,61.34 v43.69,56.13
  Bottom 0.254: U$2.31 49.98,61.34 v48.9,61.34 | v43.69,56.13 31.11,43.56 SV1.5
RST_ETH  (via drill 0.6)
  Top 0.254: U1.14 43.64,67.61 v43.69,67.56
  Bottom 0.254: U$2.32 50.76,63.25 48.01,63.25 v43.69,67.56
RST_ETH_3V
  Top 0.254: U1.7 16.82,67.61 16.13,66.93 JP2.3
SCK  (via drill 0.6)
  Top 0.254: U1.15 36.75,68.25 v37.34,68.83
  Bottom 0.254: U$2.28 48.42,56.39 46.23,56.39 38.48,64.14 38.48,68.45 38.1,68.83 v37.34,68.83
SCK_3V
  Top 0.254: U1.6 22.17,68.25 14.73,75.69 11.68,75.69 11.05,76.33 JP1.1
SERVO_PWM  (via drill 0.6)
  Top 0.254: v49.02,68.83 47.62,70.23 v47.62,76.2
  Bottom 0.254: U$2.3 52.02,68.33 49.53,68.33 v49.02,68.83 | v47.62,76.2 59.18,87.76 JP3.1
STBY  (via drill 0.6)  (3 unrouted)
  Top 0.254: v57.28,56.9 v65.41,65.02
  Bottom 0.254: U$3.5 C12.1 36.66,35.14 41.4,39.88 41.4,43.94 54.36,56.9 v57.28,56.9 | 61.81,64.22 U$2.17 62.59,65.02 v65.41,65.02
TASTER  (4 unrouted)
TRAFO1
  Top 1.676: Q3.S 58.55,18.54 56.01,21.08 Q4.D 56.01,24.77 57.66,26.42 69.77,26.42 L4.2
  Bottom 0.406: U$3.14 48.09,26.54 C_BOOT.2 49.31,25.36 50.55,24.13 50.55,19.81 | Q4.D 56.01,21.46 54.61,20.07 50.8,20.07 50.55,19.81 | 50.55,19.81 R53.2
TRAFO2
  Top 0.406: C_ISEN_A.2 54.86,29.43 L3.2
  Top 1.016: L3.2 54.89,32.26 56.26,32.26 58.93,34.92 78.87,34.92 86.1,27.69 L7.11
  Top 1.778: L7.11 86.24,27.69 79.25,20.7 79.25,16.52 C13.1
WOL_ETH_3V
  Top 0.254: U1.3 23.27,70.21 18.67,74.8 JP1.4
ÜBERSPANNUNG  (3 unrouted)